# EAGLE design M8310F (EAGLE 6.6.0)

## Sheet 1 of 3
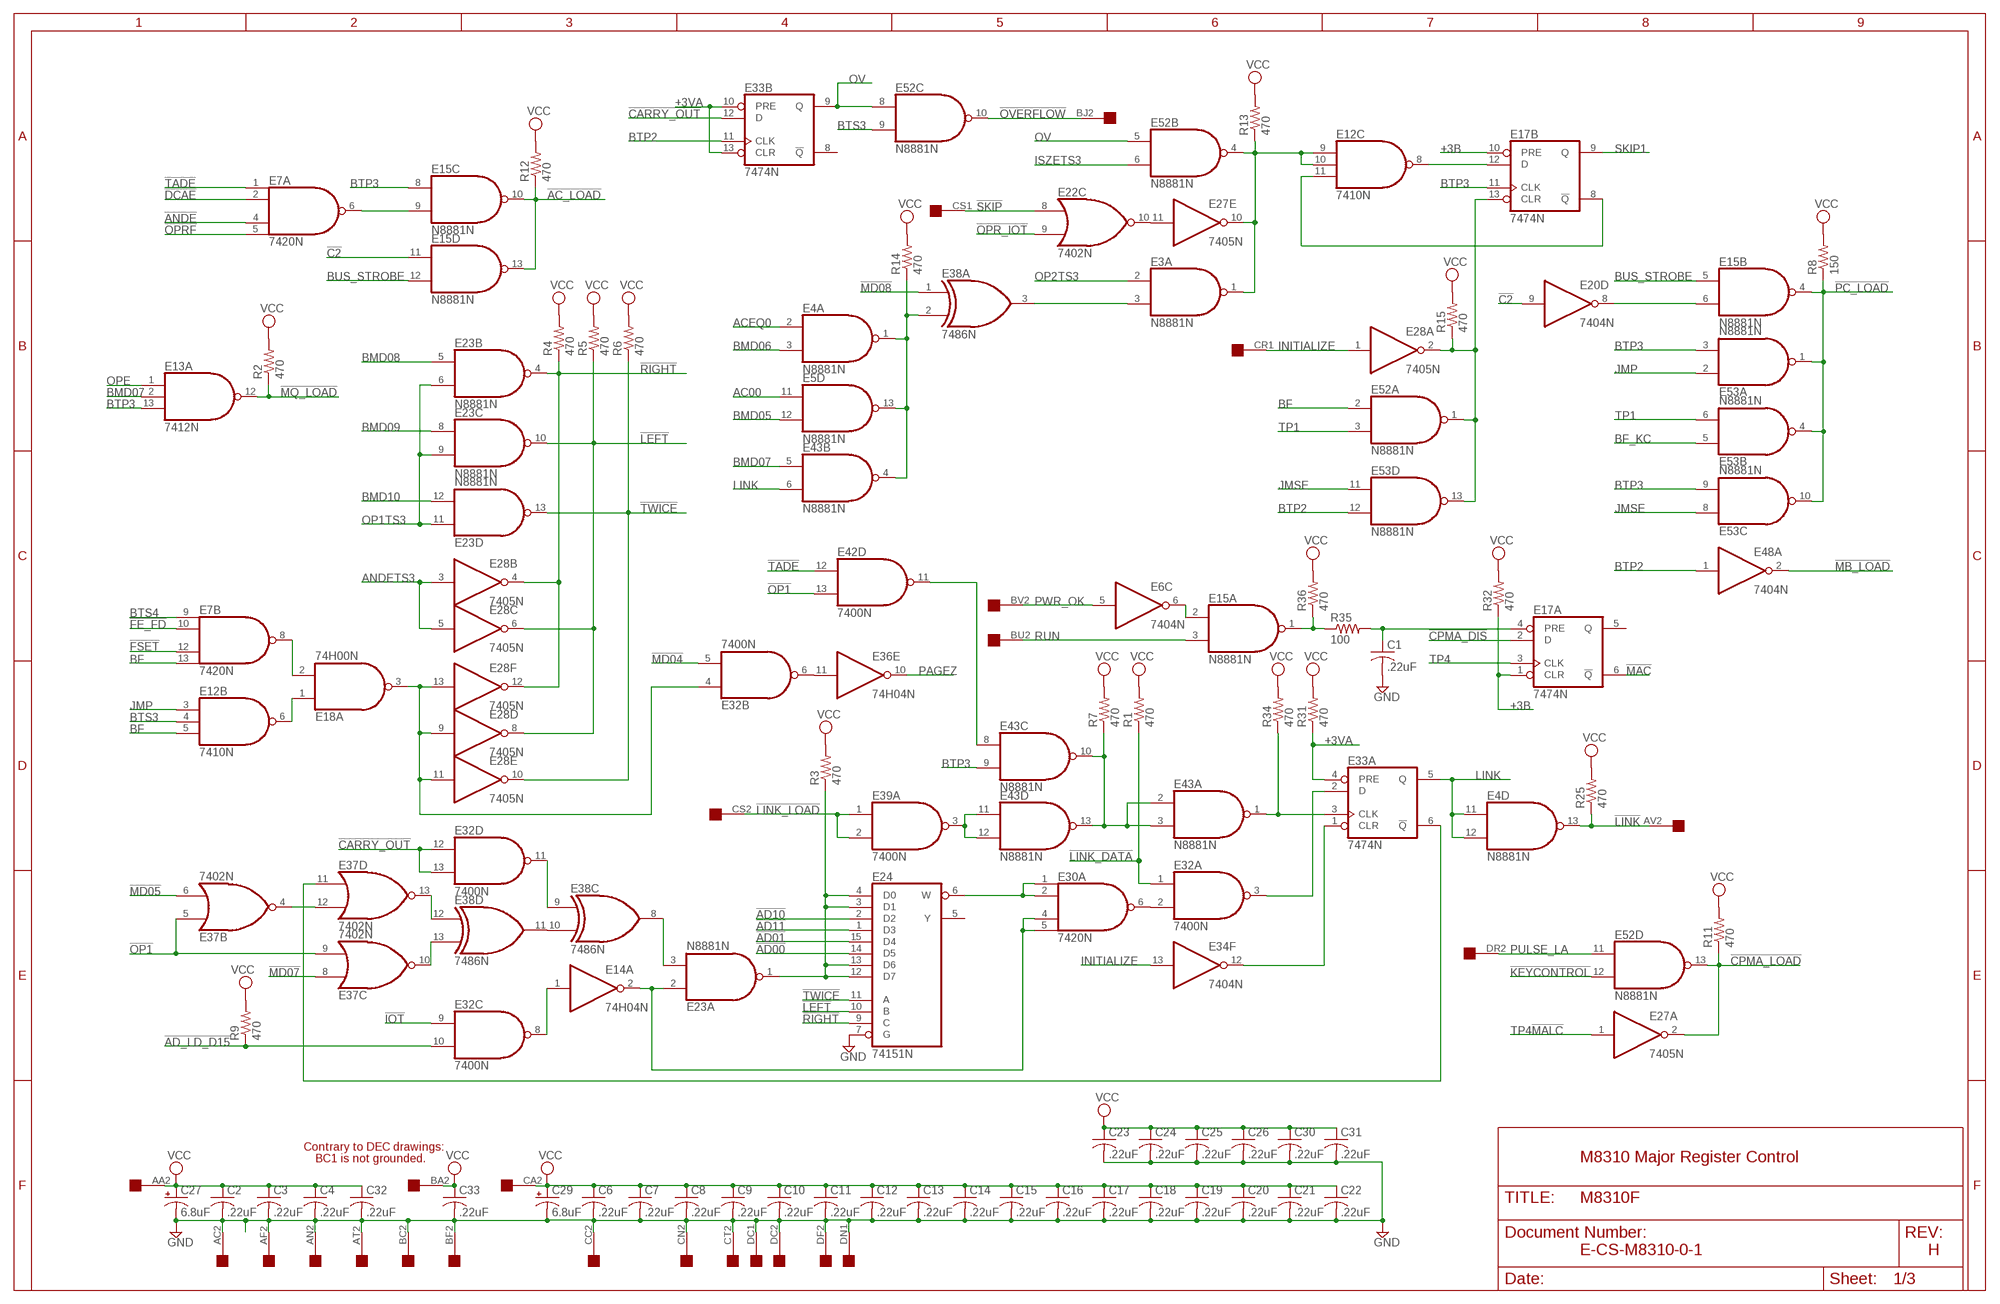
[diagram p0: schematic, sheet 1]

### Parts
C1  .22uF  C-US  [C063-025X075]
C2  .22uF  C-US  [C063-025X075]
C3  .22uF  C-US  [C063-025X075]
C4  .22uF  C-US  [C063-025X075]
C6  .22uF  C-US  [C063-025X075]
C7  .22uF  C-US  [C063-025X075]
C8  .22uF  C-US  [C063-025X075]
C9  .22uF  C-US  [C063-025X075]
C10  .22uF  C-US  [C063-025X075]
C11  .22uF  C-US  [C063-025X075]
C12  .22uF  C-US  [C063-025X075]
C13  .22uF  C-US  [C063-025X075]
C14  .22uF  C-US  [C063-025X075]
C15  .22uF  C-US  [C063-025X075]
C16  .22uF  C-US  [C063-025X075]
C17  .22uF  C-US  [C063-025X075]
C18  .22uF  C-US  [C063-025X075]
C19  .22uF  C-US  [C063-025X075]
C20  .22uF  C-US  [C063-025X075]
C21  .22uF  C-US  [C063-025X075]
C22  .22uF  C-US  [C063-025X075]
C23  .22uF  C-US  [C063-025X075]
C24  .22uF  C-US  [C063-025X075]
C25  .22uF  C-US  [C063-025X075]
C26  .22uF  C-US  [C063-025X075]
C27  6.8uF  CPOL-USE20-8AXIAL  [E12-8]
C29  6.8uF  CPOL-USE20-8AXIAL  [E12-8]
C30  .22uF  C-US  [C063-025X075]
C31  .22uF  C-US  [C063-025X075]
C32  .22uF  C-US  [C063-025X075]
C33  .22uF  C-US  [C063-025X075]
E3  N8881N  [DIL14]
E4  N8881N  [DIL14]
E5  N8881N  [DIL14]
E6  7404N  [DIL14]
E7  7420N  74S20N  [DIL14]
E12  7410N  [DIL14]
E13  7412N  [DIL14]
E14  74H04N  7404N  [DIL14]
E15  N8881N  [DIL14]
E17  7474N  74S74N  [DIL14]
E18  74H00N  7400N  [DIL14]
E20  7404N  [DIL14]
E22  7402N  [DIL14]
E23  N8881N  [DIL14]
E24  74151N  [DIL16]
E27  7405N  [DIL14]
E28  7405N  [DIL14]
E30  7420N  74S20N  [DIL14]
E32  7400N  [DIL14]
E33  7474N  74S74N  [DIL14]
E34  7404N  [DIL14]
E36  74H04N  7404N  [DIL14]
E37  7402N  [DIL14]
E38  7486N  [DIL14]
E39  7400N  [DIL14]
E42  7400N  [DIL14]
E43  N8881N  [DIL14]
E48  7404N  [DIL14]
E52  N8881N  [DIL14]
E53  N8881N  [DIL14]
R1  470  R-US_0207/10  [0207/10]
R2  470  R-US_0207/10  [0207/10]
R3  470  R-US_0207/10  [0207/10]
R4  470  R-US_0207/10  [0207/10]
R5  470  R-US_0207/10  [0207/10]
R6  470  R-US_0207/10  [0207/10]
R7  470  R-US_0207/10  [0207/10]
R8  150  R-US_0207/10  [0207/10]
R9  470  R-US_0207/10  [0207/10]
R11  470  R-US_0207/10  [0207/10]
R12  470  R-US_0207/10  [0207/10]
R13  470  R-US_0207/10  [0207/10]
R14  470  R-US_0207/10  [0207/10]
R15  470  R-US_0207/10  [0207/10]
R25  470  R-US_0207/10  [0207/10]
R31  470  R-US_0207/10  [0207/10]
R32  470  R-US_0207/10  [0207/10]
R34  470  R-US_0207/10  [0207/10]
R35  100  R-US_0207/10  [0207/10]
R36  470  R-US_0207/10  [0207/10]
U$2  QUAD  [EDGE-CON8]

### Nets
!AC_LOAD: E15.10(C:O) E15.13(D:O) R12.1 ; also sheet 2
!AD00: E24.14(D5) ; also sheet 2
!AD01: E24.15(D4) ; also sheet 2
!AD10: E24.2(D2) ; also sheet 2
!AD11: E24.1(D3) ; also sheet 2
!AD_LD_D15: E32.10(C:I1) R9.1
!ANDE: E7.4(A:I2) ; also sheet 3
!C2: E15.11(D:I0) E20.9(D:I) ; also sheet 2
!CARRY_OUT: E32.12(D:I0) E32.13(D:I1) E33.12(B:D) ; also sheet 2
!CPMA_DIS: E17.2(A:D) ; also sheet 2
!CPMA_LOAD: E27.2(A:O) E52.13(D:O) R11.1 ; also sheet 2,3
!DCAE: E7.2(A:I1) ; also sheet 3
!FE_FD: E7.10(B:I1) ; also sheet 2,3
!FSET: E7.12(B:I2) ; also sheet 3
!IOT: E32.9(C:I0) ; also sheet 3
!KEYCONTROL: E52.12(D:I1) ; also sheet 3
!LEFT: E23.10(C:O) E24.10(B) E28.6(C:O) E28.8(D:O) R5.1 ; also sheet 2
!LINK: E4.13(D:O) R25.1 U$2.AV2
!LINK_DATA: E32.1(A:I0) R1.1
!LINK_LOAD: E39.1(A:I0) E39.2(A:I1) U$2.CS2
!MAC: E17.6(A:!Q) ; also sheet 2
!MB_LOAD: E48.2(A:O) ; also sheet 2
!MD04: E32.5(B:I1) ; also sheet 2
!MD05: E37.6(B:I1) ; also sheet 2
!MD07: E37.8(C:I0) ; also sheet 2
!MD08: E38.1(A:I0) ; also sheet 3
!MQ_LOAD: E13.12(A:O) R2.1 ; also sheet 2
!OP1: E37.5(B:I0) E37.9(C:I1) E42.13(D:I1) ; also sheet 3
!OPR_IOT: E22.9(C:I1) ; also sheet 3
!OPRF: E7.5(A:I3) ; also sheet 3
!OVERFLOW: E52.10(C:O) U$2.BJ2
!PC_LOAD: E15.4(B:O) E53.1(A:O) E53.4(B:O) E53.10(C:O) R8.1 ; also sheet 2
!RIGHT: E23.4(B:O) E24.9(C) E28.4(B:O) E28.12(F:O) R4.1 ; also sheet 2
!SKIP: E22.8(C:I0) U$2.CS1
!TADE: E7.1(A:I0) E42.12(D:I0) ; also sheet 3
!TWICE: E23.13(D:O) E24.11(A) E28.10(E:O) R6.1 ; also sheet 2
+3B: E17.1(A:CLR) E17.10(B:PRE) R32.1
+3VA: E33.4(A:PRE) E33.10(B:PRE) E33.13(B:CLR) R31.1
AC00: E5.11(D:I0) ; also sheet 2,3
ACEQ0: E4.2(A:I0) ; also sheet 2,3
ANDETS3: E28.3(B:I) E28.5(C:I) ; also sheet 3
BF: E7.13(B:I3) E12.5(B:I2) E52.2(A:I0) ; also sheet 2,3
BF_KC: E53.5(B:I0) ; also sheet 2,3
BMD05: E5.12(D:I1) ; also sheet 2
BMD06: E4.3(A:I1) ; also sheet 2
BMD07: E13.2(A:I1) E43.5(B:I0) ; also sheet 2
BMD08: E23.5(B:I0) ; also sheet 3
BMD09: E23.8(C:I0) ; also sheet 3
BMD10: E23.12(D:I1) ; also sheet 3
BTP2: E33.11(B:CLK) E48.1(A:I) E53.12(D:I1) ; also sheet 3
BTP3: E13.13(A:I2) E15.8(C:I0) E17.11(B:CLK) E43.9(C:I1) E53.3(A:I1) E53.9(C:I1) ; also sheet 3
BTS3: E12.4(B:I1) E52.9(C:I1) ; also sheet 2,3
BTS4: E7.9(B:I0) ; also sheet 2,3
BUS_STROBE: E15.5(B:I0) E15.12(D:I1) ; also sheet 3
GND [supply]: C1.2 C2.2 C3.2 C4.2 C6.2 C7.2 C8.2 C9.2 C10.2 C11.2 C12.2 C13.2 C14.2 C15.2 C16.2 C17.2 C18.2 C19.2 C20.2 C21.2 C22.2 C23.2 C24.2 C25.2 C26.2 C27.- C29.- C30.2 C31.2 C32.2 C33.2 E24.7(G) U$2.AC2 U$2.AF2 U$2.AN2 U$2.AT2 U$2.BC2 U$2.BF2 U$2.CC2 U$2.CN2 U$2.CT2 U$2.DC1 U$2.DC2 U$2.DF2 U$2.DN1 ; also sheet 3
INITIALIZE: E28.1(A:I) E34.13(F:I) U$2.CR1
ISZETS3: E52.6(B:I1) ; also sheet 3
JMP: E12.3(B:I0) E53.2(A:I0) ; also sheet 2,3
JMSE: E53.8(C:I0) E53.11(D:I0) ; also sheet 3
LINK: E4.11(D:I0) E4.12(D:I1) E33.5(A:Q) E43.6(B:I1)
N$3: E18.3(A:O) E28.9(D:I) E28.11(E:I) E28.13(F:I) E32.4(B:I0)
N$4: E7.8(B:O) E18.2(A:I1)
N$5: E12.6(B:O) E18.1(A:I0)
N$6: E33.3(A:CLK) E43.1(A:O) R34.1
N$7: E33.1(A:CLR) E34.12(F:O)
N$8: E32.3(A:O) E33.2(A:D)
N$9: E43.2(A:I0) E43.3(A:I1) E43.10(C:O) E43.13(D:O) R7.1
N$10: E39.3(A:O) E43.11(D:I0) E43.12(D:I1)
N$11: E32.6(B:O) E36.11(E:I)
N$12: E30.6(A:O) E32.2(A:I1)
N$13: E24.6(W) E30.1(A:I0) E30.2(A:I1)
N$14: E23.3(A:I1) E38.8(C:O)
N$15: E14.2(A:O) E23.2(A:I0) E30.4(A:I2) E30.5(A:I3)
N$16: E23.1(A:O) E24.3(D1) E24.4(D0) E24.12(D7) E24.13(D6) R3.1
N$17: E15.1(A:O) R35.1 R36.1
N$18: E38.10(C:I1) E38.11(D:O)
N$19: E37.4(B:O) E37.12(D:I1)
N$20: E37.13(D:O) E38.12(D:I0)
N$21: E37.10(C:O) E38.13(D:I1)
N$22: E33.6(A:!Q) E37.11(D:I0)
N$23: E14.1(A:I) E32.8(C:O)
N$24: E32.11(D:O) E38.9(C:I0)
N$25: E6.6(C:O) E15.2(A:I0)
N$26: C1.1 E17.4(A:PRE) R35.2
N$28: E7.6(A:O) E15.9(C:I1)
N$29: E22.10(C:O) E27.11(E:I)
N$30: E3.1(A:O) E12.9(C:I0) E12.10(C:I1) E27.10(E:O) E52.4(B:O) R13.1
N$31: E15.6(B:I1) E20.8(D:O)
N$32: E12.8(C:O) E17.12(B:D)
N$33: E12.11(C:I2) E17.8(B:!Q)
N$34: E17.13(B:CLR) E28.2(A:O) E52.1(A:O) E53.13(D:O) R15.1
N$35: E4.1(A:O) E5.13(D:O) E38.2(A:I1) E43.4(B:O) R14.1
N$43: E3.3(A:I1) E38.3(A:O)
N$81: E42.11(D:O) E43.8(C:I0)
OP1TS3: E23.6(B:I1) E23.9(C:I1) E23.11(D:I0) ; also sheet 2,3
OP2TS3: E3.2(A:I0) ; also sheet 3
OPE: E13.1(A:I0) ; also sheet 2,3
OV: E33.9(B:Q) E52.5(B:I0) E52.8(C:I0)
PAGEZ: E36.10(E:O) ; also sheet 2
PULSE_LA: E52.11(D:I0) U$2.DR2
PWR_OK: E6.5(C:I) U$2.BV2
RUN: E15.3(A:I1) U$2.BU2
SKIP1: E17.9(B:Q) ; also sheet 2
TP1: E52.3(A:I1) E53.6(B:I1) ; also sheet 3
TP4: E17.3(A:CLK) ; also sheet 3
TP4!MALC: E27.1(A:I) ; also sheet 3
VCC [supply]: C2.1 C3.1 C4.1 C6.1 C7.1 C8.1 C9.1 C10.1 C11.1 C12.1 C13.1 C14.1 C15.1 C16.1 C17.1 C18.1 C19.1 C20.1 C21.1 C22.1 C23.1 C24.1 C25.1 C26.1 C27.+ C29.+ C30.1 C31.1 C32.1 C33.1 R1.2 R2.2 R3.2 R4.2 R5.2 R6.2 R7.2 R8.2 R9.2 R11.2 R12.2 R13.2 R14.2 R15.2 R25.2 R31.2 R32.2 R34.2 R36.2 U$2.AA2 U$2.BA2 U$2.CA2 ; also sheet 2,3
Unconnected: E6.1(A:I) E6.2(A:O) E6.3(B:I) E6.4(B:O) E6.8(D:O) E6.9(D:I) E17.5(A:Q) E24.5(Y) E33.8(B:!Q) U$2.AA1 U$2.AB1 U$2.AB2 U$2.AC1 U$2.AD1 U$2.AD2 U$2.AE1 U$2.AE2 U$2.AF1 U$2.AH1 U$2.AH2 U$2.AJ1 U$2.AJ2 U$2.AK2 U$2.AL2 U$2.AM2 U$2.AN1 U$2.AP2 U$2.AR1 U$2.AR2 U$2.AS1 U$2.AS2 U$2.AT1 U$2.AU1 U$2.AV1 U$2.BA1 U$2.BB1 U$2.BC1 U$2.BD1 U$2.BD2 U$2.BE1 U$2.BE2 U$2.BF1 U$2.BH1 U$2.BJ1 U$2.BL2 U$2.BN1 U$2.BN2 U$2.BR1 U$2.BR2 U$2.BS1 U$2.BS2 U$2.BT1 U$2.BT2 U$2.BU1 U$2.BV1 U$2.CA1 U$2.CB1 U$2.CB2 U$2.CC1 U$2.CF1 U$2.CF2 U$2.CL1 U$2.CM1 U$2.CN1 U$2.CP1 U$2.CR2 U$2.CT1 U$2.DA1 U$2.DA2 U$2.DB1 U$2.DB2 U$2.DD1 U$2.DE1 U$2.DF1 U$2.DH1 U$2.DJ1 U$2.DJ2 U$2.DK2 U$2.DL2 U$2.DM2 U$2.DN2 U$2.DR1 U$2.DS1 U$2.DS2 U$2.DT1 U$2.DT2 U$2.DU1 U$2.DV1 U$2.DV2

### Notes on the sheet
- Contrary to DEC drawings:
- BC1 is not grounded. | M8310 Major Register Control
- E-CS-M8310-0-1 | H

## Sheet 2 of 3
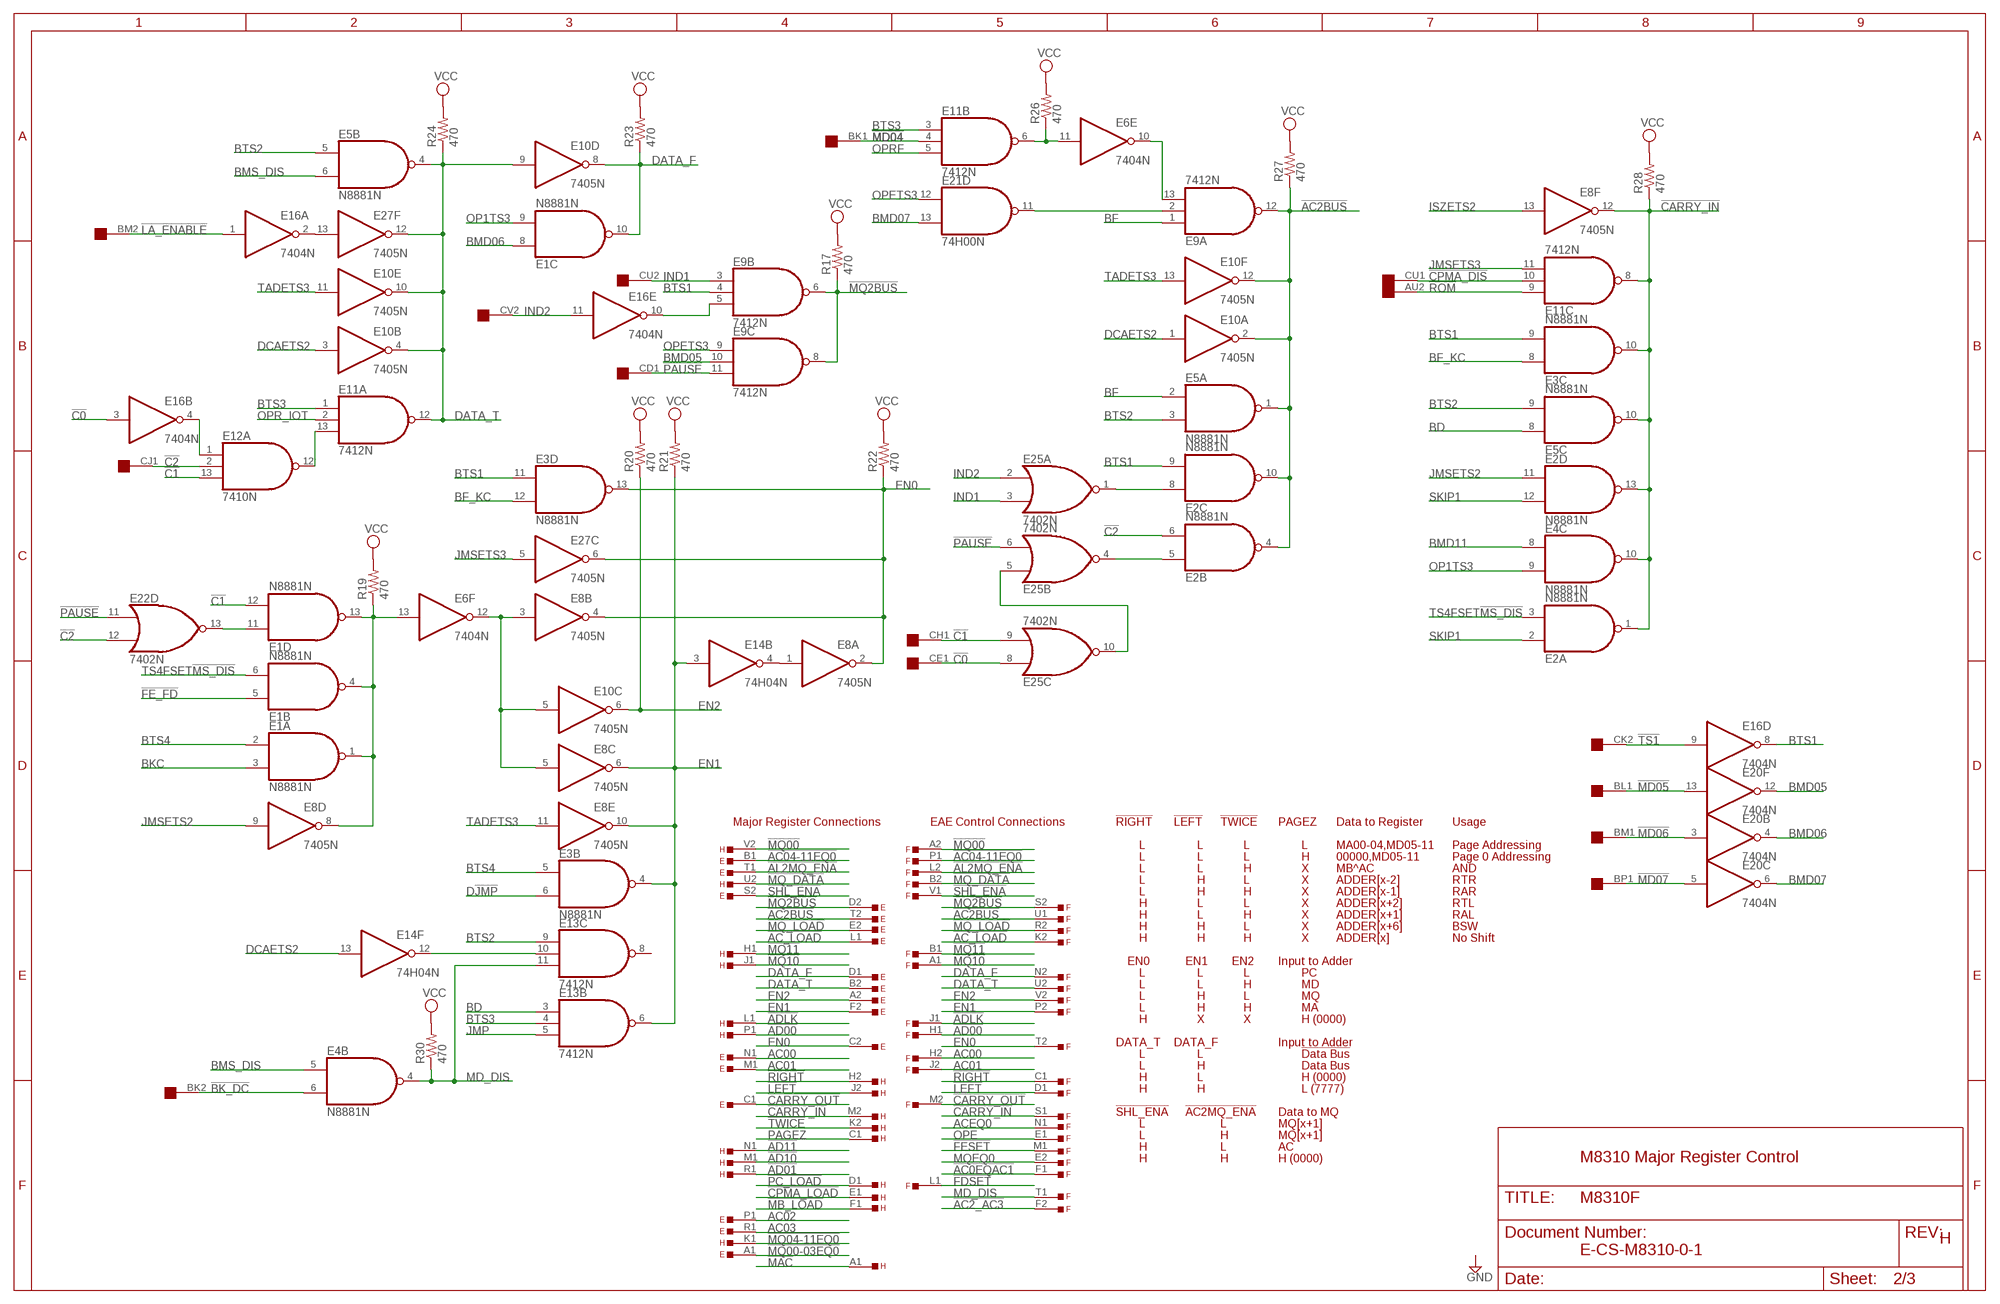
[diagram p1: schematic, sheet 2]

### Parts
E  EDGE-TOP  [EDGE-CON2]
E1  N8881N  [DIL14]
E2  N8881N  [DIL14]
E8  7405N  [DIL14]
E9  7412N  [DIL14]
E10  7405N  [DIL14]
E11  7412N  [DIL14]
E16  7404N  [DIL14]
E21  74H00N  7400N  [DIL14]
E25  7402N  [DIL14]
F  EDGE-TOP  [EDGE-CON2]
H  EDGE-TOP  [EDGE-CON2]
R17  470  R-US_0207/10  [0207/10]
R19  470  R-US_0207/10  [0207/10]
R20  470  R-US_0207/10  [0207/10]
R21  470  R-US_0207/10  [0207/10]
R22  470  R-US_0207/10  [0207/10]
R23  470  R-US_0207/10  [0207/10]
R24  470  R-US_0207/10  [0207/10]
R26  470  R-US_0207/10  [0207/10]
R27  470  R-US_0207/10  [0207/10]
R28  470  R-US_0207/10  [0207/10]
R30  470  R-US_0207/10  [0207/10]

### Nets
!AC0EQAC1: F.F1 ; also sheet 3
!AC2_AC3: F.F2 ; also sheet 3
!AC2BUS: E2.4(B:O) E2.10(C:O) E5.1(A:O) E9.12(A:O) E10.2(A:O) E10.12(F:O) E.T2 F.U1 R27.1
!AC04-11EQ0: E.B1 F.P1 ; also sheet 3
!AC_LOAD: E.L1 F.K2 ; also sheet 1
!AD00: F.H1 H.P1 ; also sheet 1
!AD01: H.R1 ; also sheet 1
!AD10: H.M1 ; also sheet 1
!AD11: H.N1 ; also sheet 1
!ADLK: F.J1 H.L1
!AL2MQ_ENA: E.T1 F.L2
!BK_DC: E4.6(B:I1) U$2.BK2
!C0: E16.3(B:I) E25.8(C:I0) U$2.CE1
!C1: E1.12(D:I1) E12.13(A:I2) E25.9(C:I1) U$2.CH1
!C2: E2.6(B:I1) E12.2(A:I1) E22.12(D:I1) U$2.CJ1 ; also sheet 1
!CARRY_IN: E2.1(A:O) E2.13(D:O) E3.10(C:O) E4.10(C:O) E5.10(C:O) E8.12(F:O) E11.8(C:O) F.S1 H.M2 R28.1
!CARRY_OUT: E.C1 F.M2 ; also sheet 1
!CPMA_DIS: E11.10(C:I1) U$2.CU1 ; also sheet 1
!CPMA_LOAD: H.E1 ; also sheet 1,3
!FDSET: F.L1 ; also sheet 3
!FE_FD: E1.5(B:I0) ; also sheet 1,3
!FESET: F.M1 ; also sheet 3
!LA_ENABLE: E16.1(A:I) U$2.BM2
!LEFT: F.D1 H.J2 ; also sheet 1
!MAC: H.A1 ; also sheet 1
!MB_LOAD: H.F1 ; also sheet 1
!MD04: E11.4(B:I1) U$2.BK1 ; also sheet 1
!MD05: E20.13(F:I) U$2.BL1 ; also sheet 1
!MD06: E20.3(B:I) U$2.BM1
!MD07: E20.5(C:I) U$2.BP1 ; also sheet 1
!MQ00: F.A2 H.V2
!MQ00-03EQ0: E.A1 ; also sheet 3
!MQ2BUS: E9.6(B:O) E9.8(C:O) E.D2 F.S2 R17.1
!MQ04-11EQ0: H.K1 ; also sheet 3
!MQ10: F.A1 H.J1
!MQ11: F.B1 H.H1
!MQ_DATA: F.B2 H.U2
!MQ_LOAD: E.E2 F.R2 ; also sheet 1
!PAUSE: E9.11(C:I2) E22.11(D:I0) E25.6(B:I1) U$2.CD1
!PC_LOAD: H.D1 ; also sheet 1
!RIGHT: F.C1 H.H2 ; also sheet 1
!ROM: E11.9(C:I0) U$2.AU2
!SHL_ENA: E.S2 F.V1
!TS1: E16.9(D:I) U$2.CK2
!TWICE: H.K2 ; also sheet 1
AC00: E.N1 F.H2 ; also sheet 1,3
AC01: E.M1 F.J2 ; also sheet 3
AC02: E.P1 ; also sheet 3
AC03: E.R1 ; also sheet 3
ACEQ0: F.N1 ; also sheet 1,3
BD: E5.8(C:I0) E13.3(B:I0) ; also sheet 3
BF: E5.2(A:I0) E9.1(A:I0) ; also sheet 1,3
BF_KC: E3.8(C:I0) E3.12(D:I1) ; also sheet 1,3
BKC: E1.3(A:I1) ; also sheet 3
BMD05: E9.10(C:I1) E20.12(F:O) ; also sheet 1
BMD06: E1.8(C:I0) E20.4(B:O) ; also sheet 1
BMD07: E20.6(C:O) E21.13(D:I1) ; also sheet 1
BMD11: E4.8(C:I0) ; also sheet 3
BMS_DIS: E4.5(B:I0) E5.6(B:I1) ; also sheet 3
BTS1: E2.9(C:I1) E3.9(C:I1) E3.11(D:I0) E9.4(B:I1) E16.8(D:O)
BTS2: E5.3(A:I1) E5.5(B:I0) E5.9(C:I1) E13.9(C:I0) ; also sheet 3
BTS3: E11.1(A:I0) E11.3(B:I0) E13.4(B:I1) ; also sheet 1,3
BTS4: E1.2(A:I0) E3.5(B:I0) ; also sheet 1,3
D!JMP: E3.6(B:I1) ; also sheet 3
DATA_F: E1.10(C:O) E10.8(D:O) E.D1 F.N2 R23.1
DATA_T: E5.4(B:O) E10.4(B:O) E10.9(D:I) E10.10(E:O) E11.12(A:O) E27.12(F:O) E.B2 F.U2 R24.1
DCAETS2: E10.1(A:I) E10.3(B:I) E14.13(F:I) ; also sheet 3
EN0: E3.13(D:O) E8.2(A:O) E8.4(B:O) E27.6(C:O) E.C2 F.T2 R22.1
EN1: E3.4(B:O) E8.6(C:O) E8.10(E:O) E13.6(B:O) E14.3(B:I) E.F2 F.P2 R21.1
EN2: E10.6(C:O) E.A2 F.V2 R20.1
IND1: E9.3(B:I0) E25.3(A:I1) U$2.CU2
IND2: E16.11(E:I) E25.2(A:I0) U$2.CV2
ISZETS2: E8.13(F:I) ; also sheet 3
JMP: E13.5(B:I2) ; also sheet 1,3
JMSETS2: E2.11(D:I0) E8.9(D:I) ; also sheet 3
JMSETS3: E11.11(C:I2) E27.5(C:I) ; also sheet 3
MD_DIS: E4.4(B:O) E13.11(C:I2) F.T1 R30.1
MQEQ0: F.E2 ; also sheet 3
N$36: E1.11(D:I0) E22.13(D:O)
N$37: E1.1(A:O) E1.4(B:O) E1.13(D:O) E6.13(F:I) E8.8(D:O) R19.1
N$38: E16.2(A:O) E27.13(F:I)
N$39: E11.13(A:I2) E12.12(A:O)
N$40: E12.1(A:I0) E16.4(B:O)
N$42: E6.10(E:O) E9.13(A:I2)
N$44: E6.11(E:I) E11.6(B:O) R26.1
N$45: E9.2(A:I1) E21.11(D:O)
N$47: E9.5(B:I2) E16.10(E:O)
N$48: E6.12(F:O) E8.3(B:I) E8.5(C:I) E10.5(C:I)
N$49: E8.1(A:I) E14.4(B:O)
N$55: E2.8(C:I0) E25.1(A:O)
N$56: E2.5(B:I0) E25.4(B:O)
N$57: E13.10(C:I1) E14.12(F:O)
N$58: E25.5(B:I0) E25.10(C:O)
OP1TS3: E1.9(C:I1) E4.9(C:I1) ; also sheet 1,3
OPE: F.E1 ; also sheet 1,3
OPETS3: E9.9(C:I0) E21.12(D:I0) ; also sheet 3
OPR_IOT: E11.2(A:I1) ; also sheet 3
OPRF: E11.5(B:I2) ; also sheet 3
PAGEZ: H.C1 ; also sheet 1
SKIP1: E2.2(A:I0) E2.12(D:I1) ; also sheet 1
TADETS3: E8.11(E:I) E10.11(E:I) E10.13(F:I) ; also sheet 3
TS4FSET!MS_DIS: E1.6(B:I1) E2.3(A:I1) ; also sheet 3
VCC [supply]: R17.2 R19.2 R20.2 R21.2 R22.2 R23.2 R24.2 R26.2 R27.2 R28.2 R30.2 ; also sheet 1,3
Unconnected: E13.8(C:O) E.E1 E.F1 E.H1 E.H2 E.J1 E.J2 E.K1 E.K2 E.L2 E.M2 E.N2 E.P2 E.R2 E.S1 E.U1 E.U2 E.V1 E.V2 F.C2 F.D2 F.K1 F.R1 H.A2 H.B1 H.B2 H.C2 H.D2 H.E2 H.F2 H.L2 H.N2 H.P2 H.R2 H.S1 H.S2 H.T1 H.T2 H.U1 H.V1

### Notes on the sheet
- Major Register Connections | EAE Control Connections | !RIGHT | !LEFT | !TWICE | PAGEZ | Data to Register | Usage
- L | L | L | L | MA00-04,MD05-11 | Page Addressing
- L | L | L | H | 00000,MD05-11 | Page 0 Addressing
- L | L | H | X | MB^AC | AND
- L | H | L | X | ADDER[x-2] | RTR
- L | H | H | X | ADDER[x-1] | RAR
- H | L | L | X | ADDER[x+2] | RTL
- H | L | H | X | ADDER[x+1] | RAL
- H | H | L | X | ADDER[x+6] | BSW
- H | H | H | X | ADDER[x] | No Shift
- EN0 | EN1 | EN2 | Input to Adder
- L | L | L | PC
- L | L | H | MD
- L | H | L | MQ
- L | H | H | MA
- H | X | X | H (0000)
- DATA_T | DATA_F | Input to Adder
- L | L | !Data Bus
- L | H | Data Bus
- H | L | H (0000)
- H | H | L (7777)
- !SHL_ENA | !AC2MQ_ENA | Data to MQ
- L | L | MQ[x+1]
- L | H | MQ[x+1]
- H | L | AC
- H | H | H (0000) | M8310 Major Register Control
- H
- E-CS-M8310-0-1

## Sheet 3 of 3
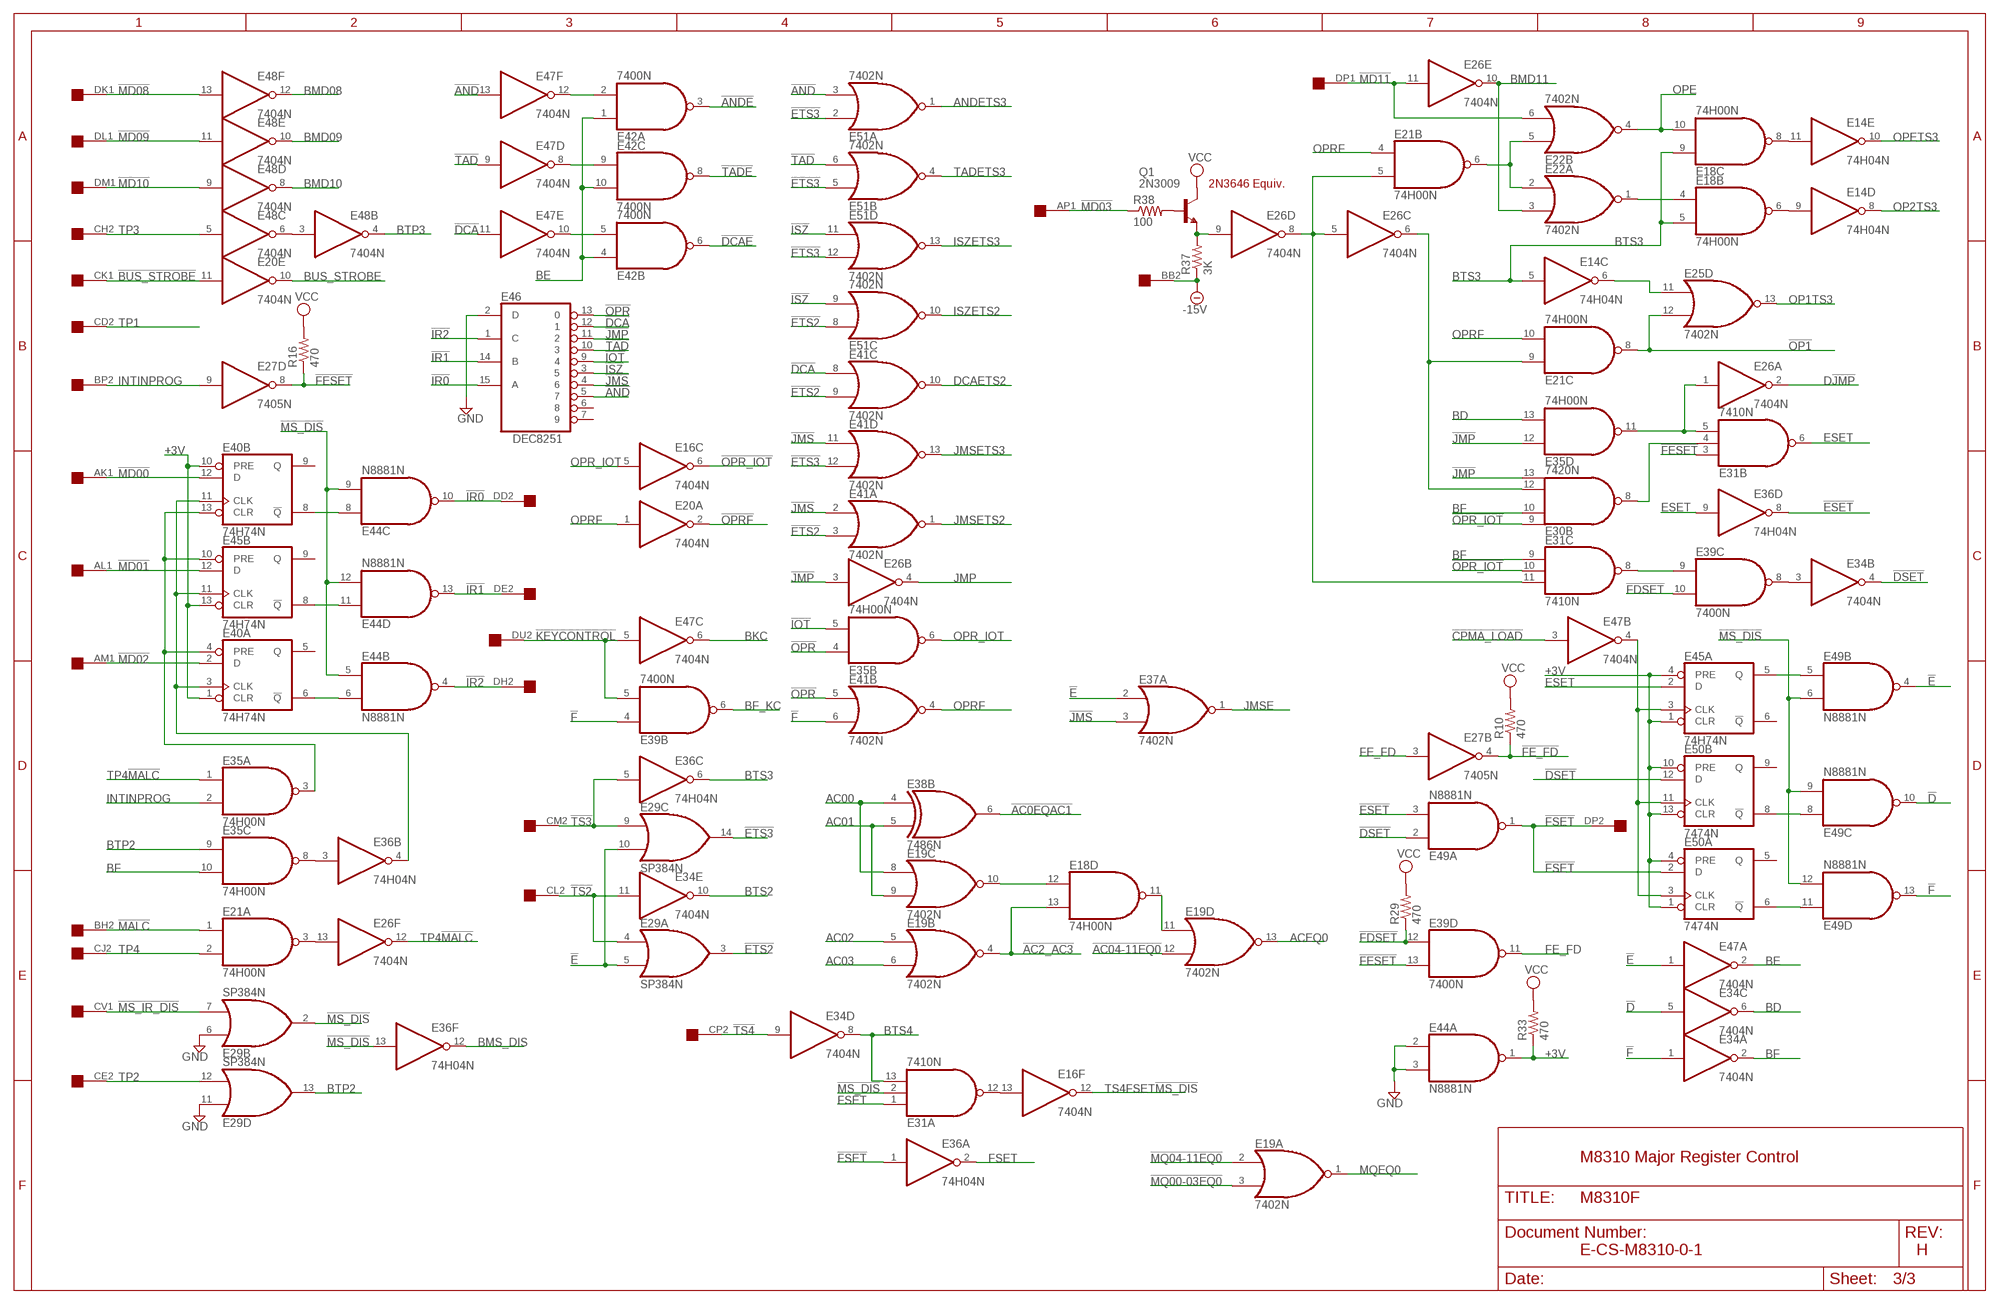
[diagram p2: schematic, sheet 3]

### Parts
E19  7402N  [DIL14]
E26  7404N  [DIL14]
E29  SP384N  [DIL14]
E31  7410N  [DIL14]
E35  74H00N  7400N  [DIL14]
E40  74H74N  74S74N  [DIL14]
E41  7402N  [DIL14]
E44  N8881N  [DIL14]
E45  74H74N  74S74N  [DIL14]
E46  DEC8251  [DIL16]
E47  7404N  [DIL14]
E49  N8881N  [DIL14]
E50  7474N  74S74N  [DIL14]
E51  7402N  [DIL14]
Q1  2N3009  -NPN-TO5  [TO5]
R10  470  R-US_0207/10  [0207/10]
R16  470  R-US_0207/10  [0207/10]
R29  470  R-US_0207/10  [0207/10]
R33  470  R-US_0207/10  [0207/10]
R37  3K  R-US_0207/10  [0207/10]
R38  100  R-US_0207/10  [0207/10]

### Nets
!AC0EQAC1: E38.6(B:O) ; also sheet 2
!AC2_AC3: E18.13(D:I1) E19.4(B:O) ; also sheet 2
!AC04-11EQ0: E19.12(D:I1) ; also sheet 2
!AND: E46.5 E47.13(F:I) E51.3(A:I1)
!ANDE: E42.3(A:O) ; also sheet 1
!BUS_STROBE: E20.11(E:I) U$2.CK1
!CPMA_LOAD: E47.3(B:I) ; also sheet 1,2
!D: E34.5(C:I) E49.10(C:O)
!DCA: E41.8(C:I0) E46.12 E47.11(E:I)
!DCAE: E42.6(B:O) ; also sheet 1
!DSET: E34.4(B:O) E49.2(A:I0) E50.12(B:D)
!E: E29.5(A:I1) E29.10(C:I1) E37.2(A:I0) E47.1(A:I) E49.4(B:O)
!ESET: E36.8(D:O) E49.3(A:I1)
!ETS2: E29.3(A:O) E41.3(A:I1) E41.9(C:I1) E51.8(C:I0)
!ETS3: E29.14(C:O) E41.12(D:I1) E51.2(A:I0) E51.5(B:I0) E51.12(D:I1)
!F: E34.1(A:I) E39.4(B:I0) E41.6(B:I1) E49.13(D:O)
!FDSET: E39.10(C:I1) E39.12(D:I0) R29.1 ; also sheet 2
!FE_FD: E27.4(B:O) R10.1 ; also sheet 1,2
!FESET: E27.8(D:O) E31.3(B:I0) E39.13(D:I1) R16.1 ; also sheet 2
!FSET: E36.1(A:I) E49.1(A:O) E50.2(A:D) U$2.DP2 ; also sheet 1
!IOT: E35.5(B:I1) E46.9 ; also sheet 1
!IR0: E44.10(C:O) E46.15(A) U$2.DD2
!IR1: E44.13(D:O) E46.14(B) U$2.DE2
!IR2: E44.4(B:O) E46.1(C) U$2.DH2
!ISZ: E46.3 E51.9(C:I1) E51.11(D:I0)
!JMP: E26.3(B:I) E30.13(B:I3) E35.12(D:I0) E46.11
!JMS: E37.3(A:I1) E41.2(A:I0) E41.11(D:I0) E46.4
!KEYCONTROL: E39.5(B:I1) E47.5(C:I) U$2.DU2 ; also sheet 1
!MALC: E21.1(A:I0) U$2.BH2
!MD00: E40.12(B:D) U$2.AK1
!MD01: E45.12(B:D) U$2.AL1
!MD02: E40.2(A:D) U$2.AM1
!MD03: R38.1 U$2.AP1
!MD08: E48.13(F:I) U$2.DK1 ; also sheet 1
!MD09: E48.11(E:I) U$2.DL1
!MD10: E48.9(D:I) U$2.DM1
!MD11: E22.6(B:I1) E26.11(E:I) U$2.DP1
!MQ00-03EQ0: E19.3(A:I1) ; also sheet 2
!MQ04-11EQ0: E19.2(A:I0) ; also sheet 2
!MS_DIS: E29.2(B:O) E31.2(A:I1) E36.13(F:I) E44.5(B:I0) E44.9(C:I1) E44.12(D:I1) E49.6(B:I1) E49.9(C:I1) E49.12(D:I1)
!MS_IR_DIS: E29.7(B:I1) U$2.CV1
!OP1: E21.8(C:O) E25.12(D:I1) ; also sheet 1
!OPR: E35.4(B:I0) E41.5(B:I0) E46.13
!OPR_IOT: E16.6(C:O) E30.9(B:I0) E31.10(C:I1) ; also sheet 1
!OPRF: E20.2(A:O) ; also sheet 1
!TAD: E46.10 E47.9(D:I) E51.6(B:I1)
!TADE: E42.8(C:O) ; also sheet 1
!TS2: E29.4(A:I0) E34.11(E:I) U$2.CL2
!TS3: E29.9(C:I0) E36.5(C:I) U$2.CM2
!TS4: E34.9(D:I) U$2.CP2
+3V [supply]: E40.1(A:CLR) E40.10(B:PRE) E44.1(A:O) E45.1(A:CLR) E45.4(A:PRE) E45.13(B:CLR) E50.1(A:CLR) E50.4(A:PRE) E50.10(B:PRE) E50.13(B:CLR) R33.1
-15V: R37.1 U$2.BB2
AC00: E19.8(C:I0) E38.4(B:I0) ; also sheet 1,2
AC01: E19.9(C:I1) E38.5(B:I1) ; also sheet 2
AC02: E19.5(B:I0) ; also sheet 2
AC03: E19.6(B:I1) ; also sheet 2
ACEQ0: E19.13(D:O) ; also sheet 1,2
ANDETS3: E51.1(A:O) ; also sheet 1
BD: E34.6(C:O) E35.13(D:I1) ; also sheet 2
BE: E42.1(A:I0) E42.4(B:I0) E42.10(C:I1) E47.2(A:O)
BF: E30.10(B:I1) E31.9(C:I0) E34.2(A:O) E35.10(C:I1) ; also sheet 1,2
BF_KC: E39.6(B:O) ; also sheet 1,2
BKC: E47.6(C:O) ; also sheet 2
BMD08: E48.12(F:O) ; also sheet 1
BMD09: E48.10(E:O) ; also sheet 1
BMD10: E48.8(D:O) ; also sheet 1
BMD11: E22.3(A:I1) E26.10(E:O) ; also sheet 2
BMS_DIS: E36.12(F:O) ; also sheet 2
BTP2: E29.13(D:O) E35.9(C:I0) ; also sheet 1
BTP3: E48.4(B:O) ; also sheet 1
BTS2: E34.10(E:O) ; also sheet 2
BTS3: E14.5(C:I) E18.5(B:I1) E18.9(C:I0) E36.6(C:O) ; also sheet 1,2
BTS4: E31.13(A:I2) E34.8(D:O) ; also sheet 1,2
BUS_STROBE: E20.10(E:O) ; also sheet 1
CPMA_LOAD: E45.3(A:CLK) E47.4(B:O) E50.3(A:CLK) E50.11(B:CLK)
D!JMP: E26.2(A:O) ; also sheet 2
DCAETS2: E41.10(C:O) ; also sheet 2
ESET: E31.6(B:O) E36.9(D:I) E45.2(A:D)
FE_FD: E27.3(B:I) E39.11(D:O)
FSET: E31.1(A:I0) E36.2(A:O)
GND [supply]: E29.6(B:I0) E29.11(D:I0) E44.2(A:I0) E44.3(A:I1) E46.2(D) ; also sheet 1
INTINPROG: E27.9(D:I) E35.2(A:I1) U$2.BP2
ISZETS2: E51.10(C:O) ; also sheet 2
ISZETS3: E51.13(D:O) ; also sheet 1
JMP: E26.4(B:O) ; also sheet 1,2
JMSE: E37.1(A:O) ; also sheet 1
JMSETS2: E41.1(A:O) ; also sheet 2
JMSETS3: E41.13(D:O) ; also sheet 2
MQEQ0: E19.1(A:O) ; also sheet 2
N$1: Q1.2(B) R38.2
N$2: E26.9(D:I) Q1.1(E) R37.2
N$41: E48.3(B:I) E48.6(C:O)
N$46: E21.5(B:I1) E26.5(C:I) E26.8(D:O) E31.11(C:I2)
N$51: E42.2(A:I1) E47.12(F:O)
N$52: E42.9(C:I0) E47.8(D:O)
N$53: E42.5(B:I1) E47.10(E:O)
N$54: E21.3(A:O) E26.13(F:I)
N$59: E35.3(A:O) E40.4(A:PRE) E40.13(B:CLR) E45.10(B:PRE)
N$60: E40.8(B:!Q) E44.8(C:I0)
N$61: E44.11(D:I0) E45.8(B:!Q)
N$62: E40.6(A:!Q) E44.6(B:I1)
N$63: E21.6(B:O) E22.2(A:I0) E22.5(B:I0)
N$64: E35.8(C:O) E36.3(B:I)
N$65: E36.4(B:O) E40.3(A:CLK) E40.11(B:CLK) E45.11(B:CLK)
N$66: E26.1(A:I) E31.5(B:I2) E35.11(D:O)
N$67: E14.6(C:O) E25.11(D:I0)
N$69: E18.4(B:I0) E22.1(A:O)
N$70: E14.11(E:I) E18.8(C:O)
N$71: E14.9(D:I) E18.6(B:O)
N$72: E30.8(B:O) E31.4(B:I1)
N$73: E45.5(A:Q) E49.5(B:I0)
N$74: E34.3(B:I) E39.8(C:O)
N$75: E31.8(C:O) E39.9(C:I0)
N$76: E21.9(C:I0) E26.6(C:O) E30.12(B:I2)
N$77: E49.8(C:I0) E50.8(B:!Q)
N$78: E49.11(D:I0) E50.6(A:!Q)
N$79: E16.13(F:I) E31.12(A:O)
N$80: E18.11(D:O) E19.11(D:I0)
N$85: E18.12(D:I0) E19.10(C:O)
OP1TS3: E25.13(D:O) ; also sheet 1,2
OP2TS3: E14.8(D:O) ; also sheet 1
OPE: E18.10(C:I1) E22.4(B:O) ; also sheet 1,2
OPETS3: E14.10(E:O) ; also sheet 2
OPR_IOT: E16.5(C:I) E35.6(B:O) ; also sheet 2
OPRF: E20.1(A:I) E21.4(B:I0) E21.10(C:I1) E41.4(B:O) ; also sheet 2
TADETS3: E51.4(B:O) ; also sheet 2
TP1: U$2.CD2 ; also sheet 1
TP2: E29.12(D:I1) U$2.CE2
TP3: E48.5(C:I) U$2.CH2
TP4: E21.2(A:I1) U$2.CJ2 ; also sheet 1
TP4!MALC: E26.12(F:O) E35.1(A:I0) ; also sheet 1
TS4FSET!MS_DIS: E16.12(F:O) ; also sheet 2
VCC [supply]: Q1.3(C) R10.2 R16.2 R29.2 R33.2 ; also sheet 1,2
Unconnected: E40.5(A:Q) E40.9(B:Q) E45.6(A:!Q) E45.9(B:Q) E46.6 E46.7 E50.5(A:Q) E50.9(B:Q)

### Notes on the sheet
- 2N3646 Equiv.
- M8310 Major Register Control
- E-CS-M8310-0-1 | H

## Power pins joined to a net without a drawn wire
GND: E1.7(P:GND) E2.7(P:GND) E3.7(P:GND) E4.7(P:GND) E5.7(P:GND) E6.7(P:GND) E7.7(P:GND) E8.7(P:GND) E9.7(P:GND) E10.7(P:GND) E11.7(P:GND) E12.7(P:GND) E13.7(P:GND) E14.7(P:GND) E15.7(P:GND) E16.7(P:GND) E17.7(P:GND) E18.7(P:GND) E19.7(P:GND) E20.7(P:GND) E21.7(P:GND) E22.7(P:GND) E23.7(P:GND) E24.8(GND) E25.7(P:GND) E26.7(P:GND) E27.7(P:GND) E28.7(P:GND) E29.1(GND) E30.7(P:GND) E31.7(P:GND) E32.7(P:GND) E33.7(P:GND) E34.7(P:GND) E35.7(P:GND) E36.7(P:GND) E37.7(P:GND) E38.7(P:GND) E39.7(P:GND) E40.7(P:GND) E41.7(P:GND) E42.7(P:GND) E43.7(P:GND) E44.7(P:GND) E45.7(P:GND) E46.8(GND) E47.7(P:GND) E48.7(P:GND) E49.7(P:GND) E50.7(P:GND) E51.7(P:GND) E52.7(P:GND) E53.7(P:GND)
VCC: E1.14(P:VCC) E2.14(P:VCC) E3.14(P:VCC) E4.14(P:VCC) E5.14(P:VCC) E6.14(P:VCC) E7.14(P:VCC) E8.14(P:VCC) E9.14(P:VCC) E10.14(P:VCC) E11.14(P:VCC) E12.14(P:VCC) E13.14(P:VCC) E14.14(P:VCC) E15.14(P:VCC) E16.14(P:VCC) E17.14(P:VCC) E18.14(P:VCC) E19.14(P:VCC) E20.14(P:VCC) E21.14(P:VCC) E22.14(P:VCC) E23.14(P:VCC) E24.16(VCC) E25.14(P:VCC) E26.14(P:VCC) E27.14(P:VCC) E28.14(P:VCC) E29.8(VCC) E30.14(P:VCC) E31.14(P:VCC) E32.14(P:VCC) E33.14(P:VCC) E34.14(P:VCC) E35.14(P:VCC) E36.14(P:VCC) E37.14(P:VCC) E38.14(P:VCC) E39.14(P:VCC) E40.14(P:VCC) E41.14(P:VCC) E42.14(P:VCC) E43.14(P:VCC) E44.14(P:VCC) E45.14(P:VCC) E46.16(VCC) E47.14(P:VCC) E48.14(P:VCC) E49.14(P:VCC) E50.14(P:VCC) E51.14(P:VCC) E52.14(P:VCC) E53.14(P:VCC)

## Library data of the parts
C1-C4 C6-C26 C30-C33 = dec-con:C-US: Capacitors with funky DEC lead spacing.
C27 C29 = dec-con:CPOL-USE20-8AXIAL: A 0.8 inch electrolytic.
E F H = dec-con:EDGE-TOP: Labeled DEC edge connector, suitable for top connector.
E1-E5 E15 E23 E43 E44 E49 E52 E53 = dec-con:N8881: Quad 2-input NAND gate, open collector
E6 E14 E16 E20 E26 E34 E36 E47 E48 = 74xx-us:74*04: Hex INVERTER
E7 E30 = 74xx-us:74*20: Dual 4-input NAND gate
E8 E10 E27 E28 = 74xx-us:74*05: Hex INVERTER, open collector
E9 E11 E13 = 74xx-us:74*12: Triple 3-input NAND gate, open collector
E12 E31 = 74xx-us:74*10: Triple 3-input NAND gate
E17 E33 E40 E45 E50 = 74xx-us:74*74: Dual D type positive edge triggered FLIP FLOP, preset and clear
E18 E21 E32 E35 E39 E42 = 74xx-us:74*00: Quad 2-input NAND gate
E19 E22 E25 E37 E41 E51 = 74xx-us:74*02: Quad 2-input NOR gate
E24 = 74xx-us:74*151: Data SELECTOR/MULTIPLEXER
E29 = dec-con:SP384: Quad OR gate
E38 = 74xx-us:74*86: Quad 2-input EXCLUSIV-OR (XOR) gate
E46 = dec-con:DEC8251: BCD Decoder
Q1 = transistor:*-NPN-: NPN Transistror BF959 corrected 2008.03.06
R1-R17 R19-R38 = rcl:R-US_: RESISTOR, American symbol
U$2 = dec-con:QUAD: Quad-Height DEC board

## Net classes
1 supply: width 0.813 mm

## Board
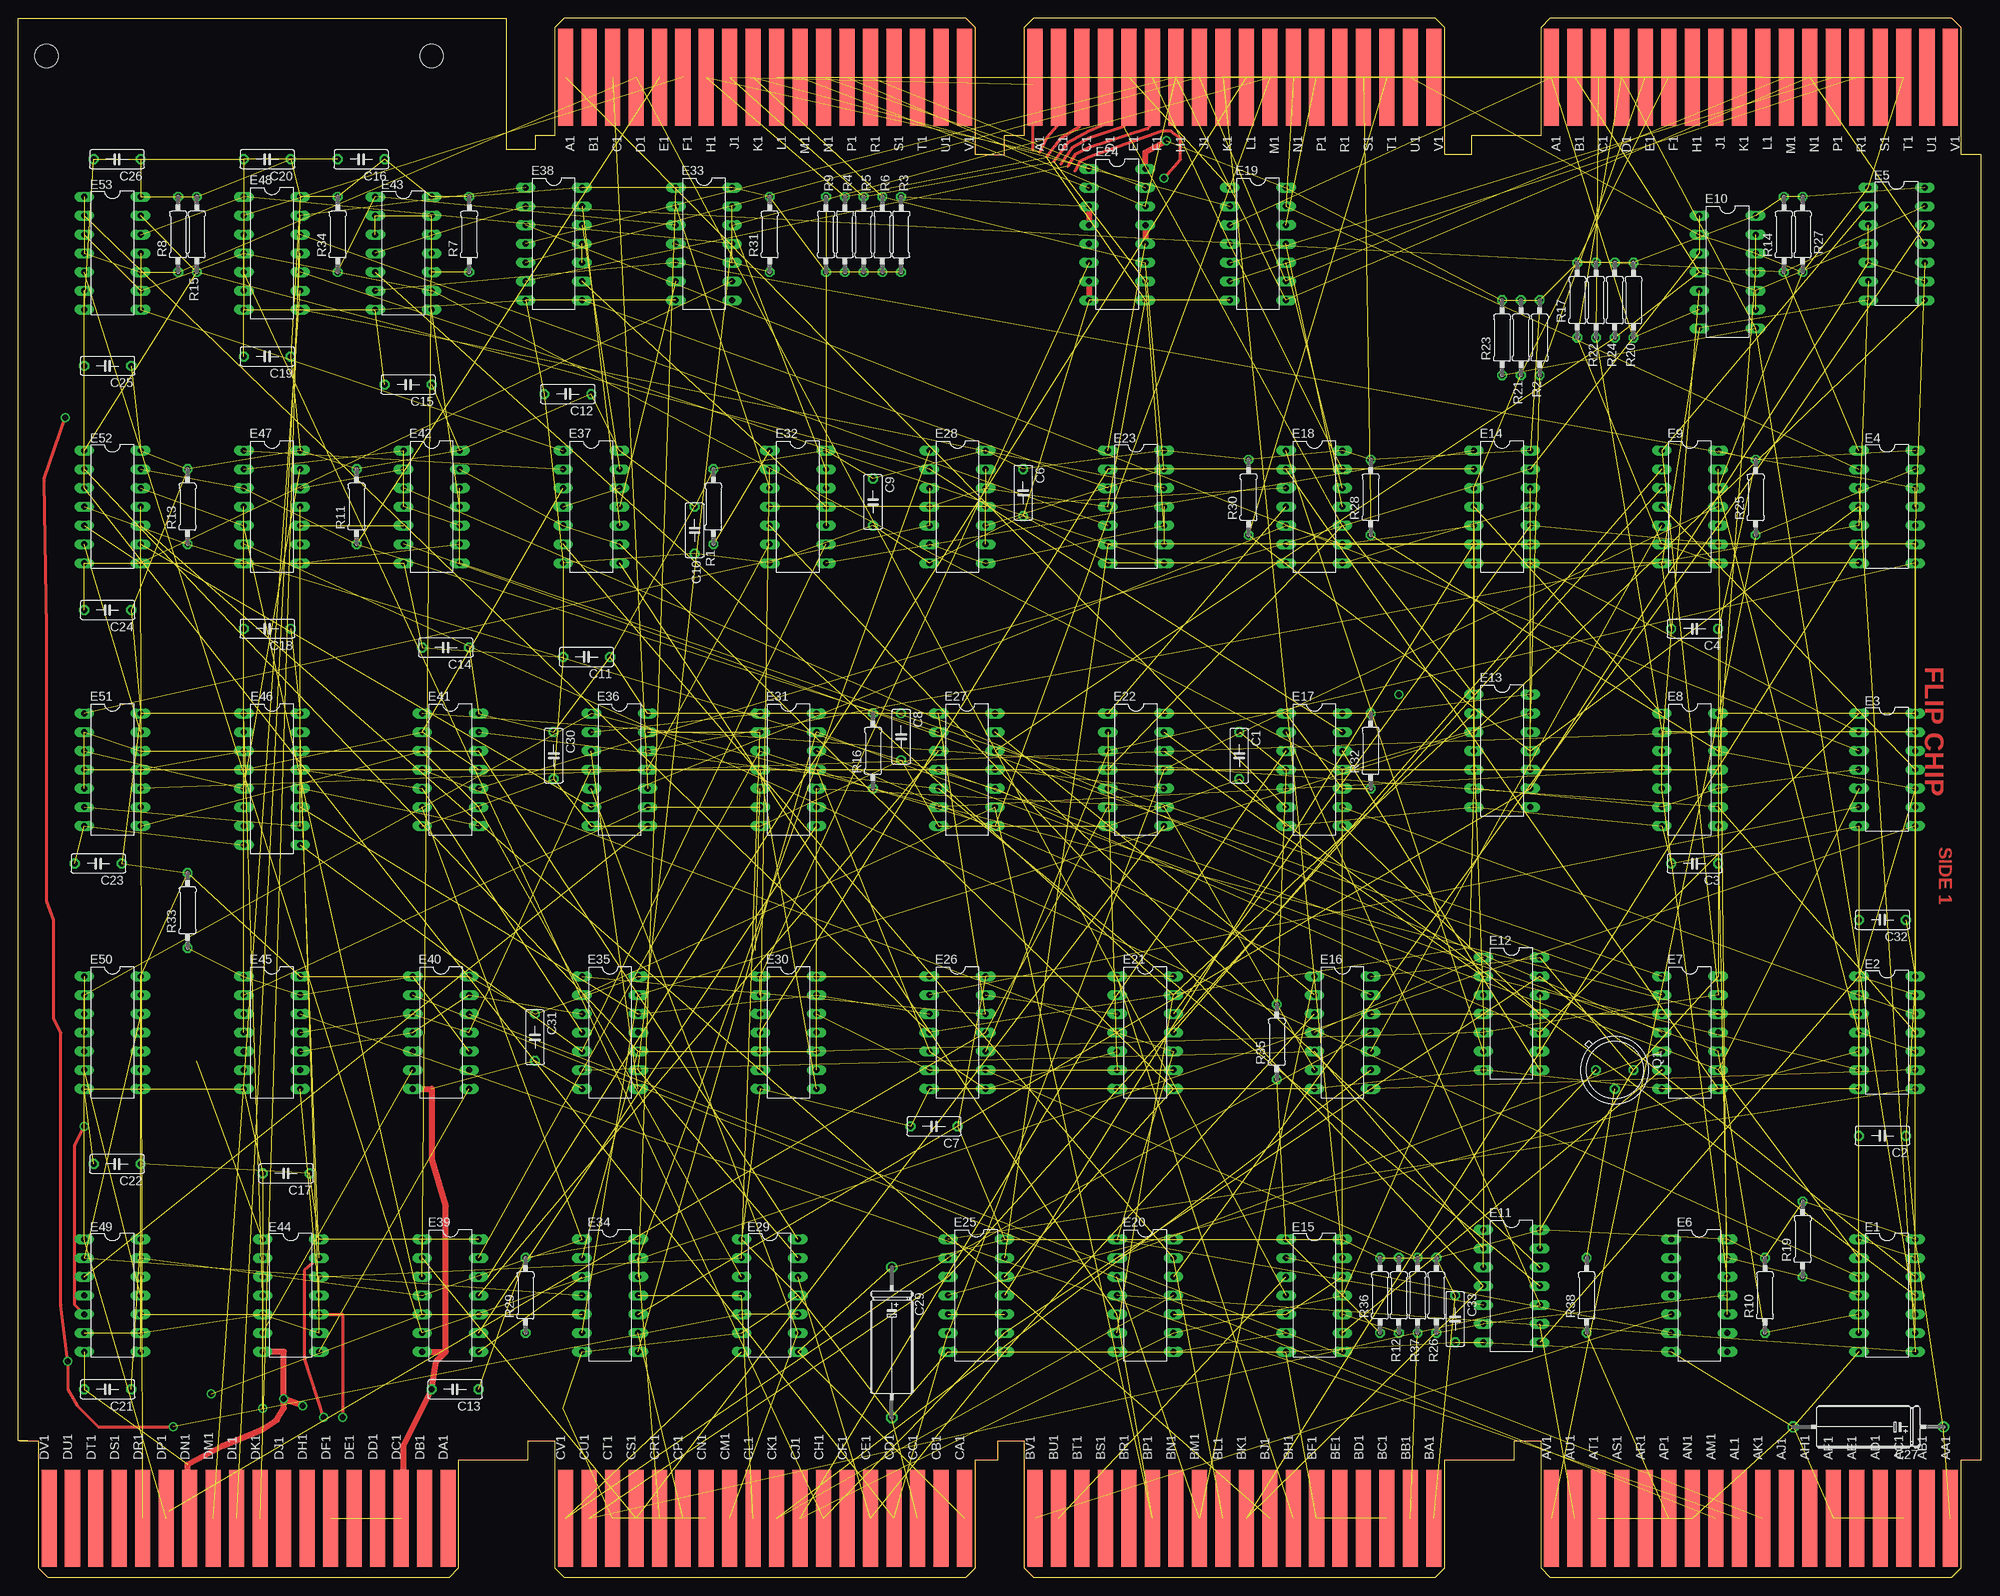
[diagram p3: board, top side]
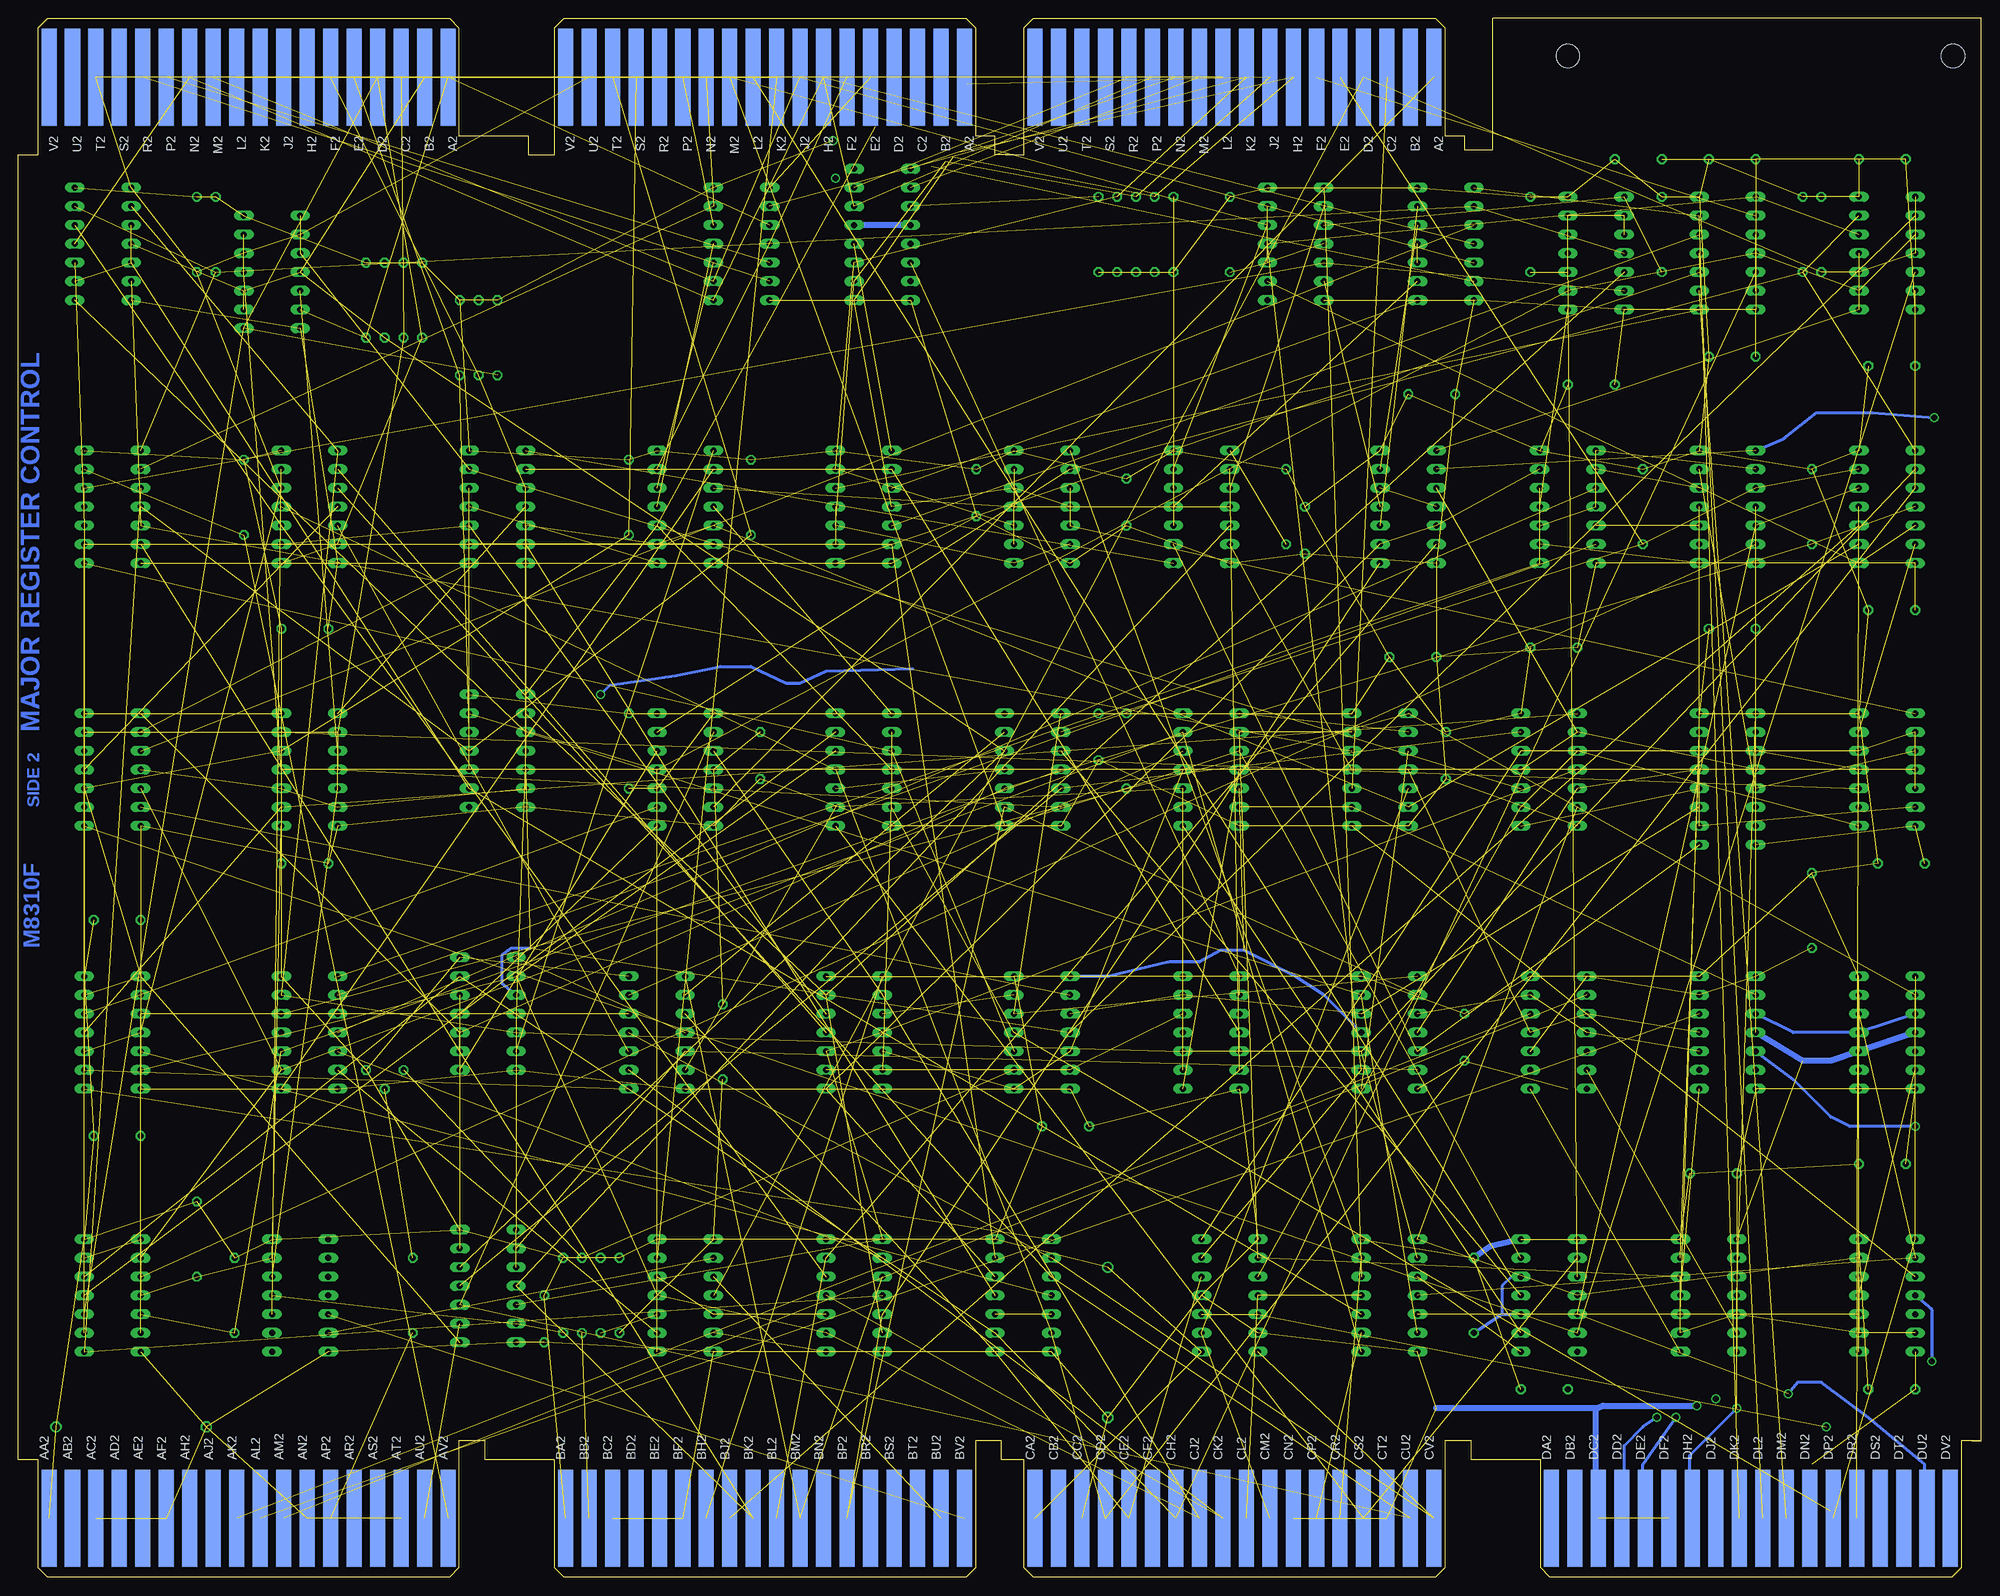
[diagram p4: board, bottom side, seen from below]

Size 265.43 x 210.82 mm. Coordinates in mm from the lower left corner, seen from the top.
Outline: 203.2,194.94 196.53,194.94 196.53,192.41 195.26,192.41
Outline: 1.27,18.41 0,18.41 0,210.82 66.04,210.82 66.04,193.04 69.85,193.04 69.85,194.94
Outline: 265.43,15.88 265.43,192.41 264.16,192.41
Outline: 130.81,192.41 133.35,192.41 133.35,194.94
Copper layers (1+16): Top 0.035mm / dielectric 1.5mm / Bottom 0.035mm
Design rules "16mils": minimum track width 16mil, minimum drill 32mil, track to track 15mil, track to pad 10mil, pad to pad 10mil, via to via 10mil, smd to smd 10mil, copper to edge 13mil, drill to drill 10mil, minimum pad ring 10mil, minimum via ring 8mil, stop-mask expansion 0mil, vias tented up to drill 0mil, thermal gap 10mil
Holes 3.2 mm at 3.81,205.74 55.88,205.74

### Footprints (pad centres in the part's own frame; a part is rotated, then mirrored left to right if it is on the bottom)
C063-025X075 = drill 0.813 octagon: 1 -2.54,0; 2 3.81,0
E12-8 = drill 1.016: + -10.16,0 | drill 1.016 octagon: - 10.16,0
EDGE-CON2 = smd 13.106 x 2.032: A1 7.938,4.128; B1 7.938,7.303; C1 7.938,10.477; D1 7.938,13.652; E1 7.938,16.828; F1 7.938,20.003; H1 7.938,23.177; J1 7.938,26.352; K1 7.938,29.527; L1 7.938,32.703; M1 7.938,35.877; N1 7.938,39.053; P1 7.938,42.227; R1 7.938,45.403; S1 7.938,48.578; T1 7.938,51.752; U1 7.938,54.928; V1 7.938,58.102 | smd 13.106 x 2.032 bottom: A2 7.938,4.128; B2 7.938,7.303; C2 7.938,10.477; D2 7.938,13.652; E2 7.938,16.828; F2 7.938,20.003; H2 7.938,23.177; J2 7.938,26.352; K2 7.938,29.527; L2 7.938,32.703; M2 7.938,35.877; N2 7.938,39.053; P2 7.938,42.227; R2 7.938,45.403; S2 7.938,48.578; T2 7.938,51.752; U2 7.938,54.928; V2 7.938,58.102
DIL14 = drill 0.813 long: 1 -7.62,-3.81; 2 -5.08,-3.81; 3 -2.54,-3.81; 4 0,-3.81; 5 2.54,-3.81; 6 5.08,-3.81; 7 7.62,-3.81; 8 7.62,3.81; 9 5.08,3.81; 10 2.54,3.81; 11 0,3.81; 12 -2.54,3.81; 13 -5.08,3.81; 14 -7.62,3.81
DIL16 = drill 0.813 long: 1 -8.89,-3.81; 2 -6.35,-3.81; 3 -3.81,-3.81; 4 -1.27,-3.81; 5 1.27,-3.81; 6 3.81,-3.81; 7 6.35,-3.81; 8 8.89,-3.81; 9 8.89,3.81; 10 6.35,3.81; 11 3.81,3.81; 12 1.27,3.81; 13 -1.27,3.81; 14 -3.81,3.81; 15 -6.35,3.81; 16 -8.89,3.81
TO5 = drill 0.813 octagon: 1 0,-2.54; 2 2.54,0; 3 0,2.54
0207/10 = drill 0.813 octagon: 1 -5.08,0; 2 5.08,0
EDGE-CON8 = smd 2.032 x 13.106: AA1 261.303,7.938; AB1 258.127,7.938; AC1 254.952,7.938; AD1 251.778,7.938; AE1 248.602,7.938; AF1 245.428,7.938; AH1 242.252,7.938; AJ1 239.077,7.938; AK1 235.903,7.938; AL1 232.727,7.938; AM1 229.553,7.938; AN1 226.377,7.938; AP1 223.202,7.938; AR1 220.028,7.938; AS1 216.852,7.938; AT1 213.678,7.938; AU1 210.502,7.938; AV1 207.327,7.938; BA1 191.452,7.938; BB1 188.278,7.938; BC1 185.102,7.938; BD1 181.928,7.938; BE1 178.752,7.938; BF1 175.577,7.938; BH1 172.403,7.938; BJ1 169.227,7.938; BK1 166.053,7.938; BL1 162.877,7.938; BM1 159.702,7.938; BN1 156.528,7.938; BP1 153.352,7.938; BR1 150.178,7.938; BS1 147.002,7.938; BT1 143.827,7.938; BU1 140.653,7.938; BV1 137.477,7.938; CA1 127.953,7.938; CB1 124.778,7.938; CC1 121.603,7.938; CD1 118.427,7.938; CE1 115.252,7.938; CF1 112.078,7.938; CH1 108.903,7.938; CJ1 105.728,7.938; CK1 102.552,7.938; CL1 99.377,7.938; CM1 96.203,7.938; CN1 93.028,7.938; CP1 89.853,7.938; CR1 86.677,7.938; CS1 83.502,7.938; CT1 80.328,7.938; CU1 77.153,7.938; CV1 73.978,7.938; DA1 58.102,7.938; DB1 54.928,7.938; DC1 51.752,7.938; DD1 48.578,7.938; DE1 45.403,7.938; DF1 42.227,7.938; DH1 39.053,7.938; DJ1 35.877,7.938; DK1 32.703,7.938; DL1 29.527,7.938; DM1 26.352,7.938; DN1 23.177,7.938; DP1 20.003,7.938; DR1 16.828,7.938; DS1 13.652,7.938; DT1 10.477,7.938; DU1 7.303,7.938; DV1 4.128,7.938 | smd 2.032 x 13.106 bottom: AA2 261.303,7.938; AB2 258.127,7.938; AC2 254.952,7.938; AD2 251.778,7.938; AE2 248.602,7.938; AF2 245.428,7.938; AH2 242.252,7.938; AJ2 239.077,7.938; AK2 235.903,7.938; AL2 232.727,7.938; AM2 229.553,7.938; AN2 226.377,7.938; AP2 223.202,7.938; AR2 220.028,7.938; AS2 216.852,7.938; AT2 213.678,7.938; AU2 210.502,7.938; AV2 207.327,7.938; BA2 191.452,7.938; BB2 188.278,7.938; BC2 185.102,7.938; BD2 181.928,7.938; BE2 178.752,7.938; BF2 175.577,7.938; BH2 172.403,7.938; BJ2 169.227,7.938; BK2 166.053,7.938; BL2 162.877,7.938; BM2 159.702,7.938; BN2 156.528,7.938; BP2 153.352,7.938; BR2 150.178,7.938; BS2 147.002,7.938; BT2 143.827,7.938; BU2 140.653,7.938; BV2 137.477,7.938; CA2 127.953,7.938; CB2 124.778,7.938; CC2 121.603,7.938; CD2 118.427,7.938; CE2 115.252,7.938; CF2 112.078,7.938; CH2 108.903,7.938; CJ2 105.728,7.938; CK2 102.552,7.938; CL2 99.377,7.938; CM2 96.203,7.938; CN2 93.028,7.938; CP2 89.853,7.938; CR2 86.677,7.938; CS2 83.502,7.938; CT2 80.328,7.938; CU2 77.153,7.938; CV2 73.978,7.938; DA2 58.102,7.938; DB2 54.928,7.938; DC2 51.752,7.938; DD2 48.578,7.938; DE2 45.403,7.938; DF2 42.227,7.938; DH2 39.053,7.938; DJ2 35.877,7.938; DK2 32.703,7.938; DL2 29.527,7.938; DM2 26.352,7.938; DN2 23.177,7.938; DP2 20.003,7.938; DR2 16.828,7.938; DS2 13.652,7.938; DT2 10.477,7.938; DU2 7.303,7.938; DV2 4.128,7.938

### Placement (x,y rotation side)
C1  165.1,111.76 270 top
C2  252.73,59.69 180 top
C3  227.33,96.52 180 top
C4  227.33,128.27 180 top
C6  135.89,147.32 270 top
C7  124.46,60.96 180 top
C8  119.38,114.3 270 top
C9  115.57,146.05 270 top
C10  91.44,142.24 270 top
C11  77.47,124.46 180 top
C12  74.93,160.02 180 top
C13  59.69,25.4 180 top
C14  58.42,125.73 180 top
C15  53.34,161.29 180 top
C16  46.99,191.77 180 top
C17  36.83,54.61 180 top
C18  34.29,128.27 180 top
C19  34.29,165.1 180 top
C20  34.29,191.77 180 top
C21  12.7,25.4 180 top
C22  13.97,55.88 180 top
C23  11.43,96.52 180 top
C24  12.7,130.81 180 top
C25  12.7,163.83 180 top
C26  13.97,191.77 180 top
C27  250.19,20.32 180 top
C29  118.11,31.75 270 top
C30  72.39,111.76 270 top
C31  69.85,73.66 270 top
C32  252.73,88.9 180 top
C33  194.31,35.56 270 top
E  203.2,210.82 270 top
E1  252.73,38.1 270 top
E2  252.73,73.66 270 top
E3  252.73,109.22 270 top
E4  252.73,144.78 270 top
E5  254,180.34 270 top
E6  227.33,38.1 270 top
E7  226.06,73.66 270 top
E8  226.06,109.22 270 top
E9  226.06,144.78 270 top
E10  231.14,176.53 270 top
E11  201.93,39.37 270 top
E12  201.93,76.2 270 top
E13  200.66,111.76 270 top
E14  200.66,144.78 270 top
E15  175.26,38.1 270 top
E16  179.07,73.66 270 top
E17  175.26,109.22 270 top
E18  175.26,144.78 270 top
E19  167.64,180.34 270 top
E20  152.4,38.1 270 top
E21  152.4,73.66 270 top
E22  151.13,109.22 270 top
E23  151.13,144.78 270 top
E24  148.59,181.61 270 top
E25  129.54,38.1 270 top
E26  127,73.66 270 top
E27  128.27,109.22 270 top
E28  127,144.78 270 top
E29  101.6,38.1 270 top
E30  104.14,73.66 270 top
E31  104.14,109.22 270 top
E32  105.41,144.78 270 top
E33  92.71,180.34 270 top
E34  80.01,38.1 270 top
E35  80.01,73.66 270 top
E36  81.28,109.22 270 top
E37  77.47,144.78 270 top
E38  72.39,180.34 270 top
E39  58.42,38.1 270 top
E40  57.15,73.66 270 top
E41  58.42,109.22 270 top
E42  55.88,144.78 270 top
E43  52.07,179.07 270 top
E44  36.83,38.1 270 top
E45  34.29,73.66 270 top
E46  34.29,107.95 270 top
E47  34.29,144.78 270 top
E48  34.29,179.07 270 top
E49  12.7,38.1 270 top
E50  12.7,73.66 270 top
E51  12.7,109.22 270 top
E52  12.7,144.78 270 top
E53  12.7,179.07 270 top
F  133.35,210.82 270 top
H  69.85,210.82 270 top
Q1  215.9,68.58 270 top
R1  93.98,144.78 90 top
R2  205.74,167.64 90 top
R3  119.38,181.61 270 top
R4  111.76,181.61 270 top
R5  114.3,181.61 270 top
R6  116.84,181.61 270 top
R7  60.96,181.61 90 top
R8  21.59,181.61 90 top
R9  109.22,181.61 270 top
R10  236.22,38.1 90 top
R11  45.72,144.78 90 top
R12  186.69,38.1 90 top
R13  22.86,144.78 90 top
R14  238.76,181.61 90 top
R15  24.13,181.61 90 top
R16  115.57,111.76 90 top
R17  210.82,172.72 90 top
R19  241.3,45.72 90 top
R20  218.44,172.72 90 top
R21  203.2,167.64 90 top
R22  213.36,172.72 90 top
R23  200.66,167.64 90 top
R24  215.9,172.72 90 top
R25  234.95,146.05 90 top
R26  191.77,38.1 90 top
R27  241.3,181.61 90 top
R28  182.88,146.05 90 top
R29  68.58,38.1 90 top
R30  166.37,146.05 90 top
R31  101.6,181.61 90 top
R32  182.88,111.76 90 top
R33  22.86,90.17 90 top
R34  43.18,181.61 90 top
R35  170.18,72.39 90 top
R36  184.15,38.1 90 top
R37  189.23,38.1 90 top
R38  212.09,38.1 90 top
U$2  0,0 0 top

### Tracks (layer width: path | path; a pad name or v marks a point on that pad's centre or on a via)
!AC0EQAC1  (1 unrouted)
  Top 0.406: F.F1 153.67,203.2 153.67,196.85 152.72,195.9 144.78,193.36 142.88,192.41 141.92,190.82
!AC2_AC3  (2 unrouted)
!AC2BUS  (8 unrouted)
!AC04-11EQ0  (2 unrouted)
!AC_LOAD  (4 unrouted)
!AD00  (2 unrouted)
!AD01  (1 unrouted)
!AD10  (1 unrouted)
!AD11  (1 unrouted)
!AD_LD_D15  (1 unrouted)
!ADLK  (1 unrouted)
!AL2MQ_ENA  (1 unrouted)
!AND  (2 unrouted)
!ANDE  (1 unrouted)
!BK_DC  (1 unrouted)
!BUS_STROBE  (1 unrouted)
!C0  (2 unrouted)
!C1  (3 unrouted)
!C2  (5 unrouted)
!CARRY_IN  (9 unrouted)
!CARRY_OUT  (4 unrouted)
!CPMA_DIS  (2 unrouted)
!CPMA_LOAD  (4 unrouted)
!D  (1 unrouted)
!DCA  (2 unrouted)
!DCAE  (1 unrouted)
!DSET  (2 unrouted)
!E  (via drill 0.81)  (3 unrouted)
  Top 0.406: v20.95,20.32 10.79,20.32 7.94,23.18 6.67,25.4 v6.67,29.21 5.71,36.83 5.71,73.66 4.76,75.56 4.76,88.9 3.81,91.44 3.81,128.27 3.49,148.27 3.49,148.59 v6.35,156.84
  Bottom 0.406: E49.4 6.67,36.2 v6.67,29.21 | E47.1 26.67,153.99 22.23,157.48 14.61,157.48 v6.35,156.84
!ESET  (1 unrouted)
!ETS2  (3 unrouted)
!ETS3  (4 unrouted)
!F  (3 unrouted)
!FDSET  (1 unrouted)
  Bottom 0.406: E39.12 63.5,40.64 64.77,39.37 64.77,35.56 | 64.77,35.56 E39.10 | R29.1 64.77,35.56
!FE_FD  (3 unrouted)
!FESET  (4 unrouted)
!FSET  (4 unrouted)
!IOT  (2 unrouted)
!IR0  (via drill 0.81)  (1 unrouted)
  Top 0.406: E44.10 43.81,35.56 v43.81,21.59
  Bottom 0.406: U$2.DD2 48.26,10.16 48.26,17.78 45.72,20.32 v43.81,21.59
!IR1  (via drill 0.81)  (1 unrouted)
  Top 0.406: v41.27,21.59 38.73,29.53 38.73,41.59 E44.13
  Bottom 0.406: U$2.DE2 45.72,8.89 45.72,15.24 v41.27,21.59
!IR2  (via drill 0.81)  (2 unrouted)
  Bottom 0.406: U$2.DH2 39.37,8.89 39.37,16.51 v33.02,22.86
!ISZ  (2 unrouted)
!JMP  (3 unrouted)
!JMS  (3 unrouted)
!KEYCONTROL  (via drill 0.81)  (3 unrouted)
  Bottom 0.406: U$2.DU2 7.62,8.89 7.62,15.24 15.24,21.59 21.59,26.35 24.77,26.35 v26.04,24.77
!LA_ENABLE  (1 unrouted)
!LEFT  (6 unrouted)
  Top 0.406: F.D1 147.32,200.66 147,196.53 144.78,195.58 141.92,193.99 140.02,191.45
!LINK  (2 unrouted)
!LINK_DATA  (1 unrouted)
!LINK_LOAD  (2 unrouted)
!MAC  (1 unrouted)
!MALC  (1 unrouted)
!MB_LOAD  (1 unrouted)
!MD00  (1 unrouted)
!MD01  (1 unrouted)
!MD02  (1 unrouted)
!MD03  (1 unrouted)
!MD04  (2 unrouted)
!MD05  (2 unrouted)
!MD06  (1 unrouted)
!MD07  (2 unrouted)
!MD08  (2 unrouted)
!MD09  (1 unrouted)
!MD10  (1 unrouted)
!MD11  (2 unrouted)
  Top 0.406: U$2.DP1 20.32,8.89
!MQ00  (1 unrouted)
!MQ00-03EQ0  (1 unrouted)
!MQ2BUS  (4 unrouted)
!MQ04-11EQ0  (1 unrouted)
!MQ10  (1 unrouted)
  Top 0.406: F.A1 137.16,201.93 137.16,193.04
!MQ11  (1 unrouted)
  Top 0.406: F.B1 140.97,201.93 140.97,196.85 139.06,194.63 138.11,192.72
!MQ_DATA  (1 unrouted)
!MQ_LOAD  (3 unrouted)
!MS_DIS  (8 unrouted)
!MS_IR_DIS  (1 unrouted)
!OP1  (4 unrouted)
!OPR  (2 unrouted)
!OPR_IOT  (3 unrouted)
!OPRF  (1 unrouted)
!OVERFLOW  (1 unrouted)
!PAUSE  (3 unrouted)
!PC_LOAD  (5 unrouted)
!RIGHT  (6 unrouted)
  Top 0.406: F.C1 143.51,201.93 143.51,196.22 140.97,194.63 139.06,192.09
!ROM  (1 unrouted)
!SHL_ENA  (1 unrouted)
!SKIP  (1 unrouted)
!TAD  (2 unrouted)
!TADE  (2 unrouted)
!TS1  (1 unrouted)
!TS2  (2 unrouted)
!TS3  (2 unrouted)
!TS4  (1 unrouted)
!TWICE  (4 unrouted)
+3B  (2 unrouted)
+3V  (8 unrouted)
  Bottom 0.813: E50.4 E50.10 20.32,69.85 24.13,69.85 E45.4
+3VA  (3 unrouted)
-15V  (1 unrouted)
AC00  (4 unrouted)
AC01  (3 unrouted)
AC02  (1 unrouted)
AC03  (1 unrouted)
ACEQ0  (2 unrouted)
ANDETS3  (2 unrouted)
BD  (3 unrouted)
BE  (3 unrouted)
BF  (8 unrouted)
BF_KC  (3 unrouted)
BKC  (1 unrouted)
BMD05  (2 unrouted)
BMD06  (2 unrouted)
BMD07  (3 unrouted)
BMD08  (1 unrouted)
BMD09  (1 unrouted)
BMD10  (1 unrouted)
BMD11  (2 unrouted)
BMS_DIS  (2 unrouted)
BTP2  (4 unrouted)
BTP3  (6 unrouted)
BTS1  (4 unrouted)
BTS2  (4 unrouted)
BTS3  (8 unrouted)
BTS4  (4 unrouted)
BUS_STROBE  (2 unrouted)
CPMA_LOAD  (1 unrouted)
  Bottom 0.406: E50.3 E50.11 25.4,73.66 E45.3
D!JMP  (1 unrouted)
DATA_F  (4 unrouted)
DATA_T  (8 unrouted)
DCAETS2  (3 unrouted)
EN0  (6 unrouted)
EN1  (7 unrouted)
EN2  (3 unrouted)
ESET  (2 unrouted)
FE_FD  (1 unrouted)
FSET  (1 unrouted)
GND  (via drill 0.81)  (96 unrouted)
  Top 0.813: E24.7 E24.8 | U$2.DC1 52.07,8.89 52.07,17.78 C13.2 56.52,29.21 57.78,30.48 | U$2.DN1 22.86,8.89 22.86,15.24 27.62,17.78 33.02,20 34.92,21.27 35.88,22.86 v35.88,24.13 | v38.42,23.18 v35.88,24.13 | v35.88,24.13 35.88,30.48 E44.7 | 57.78,30.48 57.78,50.16 55.88,56.52 55.88,66.04 E40.7 | E39.7 57.78,30.48
  Bottom 0.813: U$2.DC1 52.07,8.89 52.07,22.86 | 52.07,22.86 73.66,22.86 | 52.07,22.86 51.12,23.18 v38.42,23.18
IND1  (2 unrouted)
IND2  (2 unrouted)
INITIALIZE  (2 unrouted)
INTINPROG  (2 unrouted)
ISZETS2  (1 unrouted)
ISZETS3  (1 unrouted)
JMP  (3 unrouted)
  Bottom 0.406: E12.3 200.03,80.33 200.03,84.14 198.75,85.09 196.22,85.09
JMSE  (2 unrouted)
JMSETS2  (2 unrouted)
JMSETS3  (2 unrouted)
LINK  (3 unrouted)
MD_DIS  (3 unrouted)
MQEQ0  (1 unrouted)
N$1  (1 unrouted)
N$2  (2 unrouted)
N$3  (4 unrouted)
N$4  (1 unrouted)
N$5  (1 unrouted)
N$6  (2 unrouted)
N$7  (1 unrouted)
N$8  (1 unrouted)
N$9  (4 unrouted)
N$10  (2 unrouted)
N$11  (1 unrouted)
N$12  (1 unrouted)
N$13  (2 unrouted)
N$14  (1 unrouted)
N$15  (3 unrouted)
N$16  (2 unrouted)
  Top 0.813: E24.3 E24.4 | E24.13 E24.12
  Bottom 0.813: E24.4 E24.13
N$17  (2 unrouted)
N$18  (1 unrouted)
N$19  (1 unrouted)
N$20  (1 unrouted)
N$21  (1 unrouted)
N$22  (1 unrouted)
N$23  (1 unrouted)
N$24  (1 unrouted)
N$25  (1 unrouted)
N$26  (2 unrouted)
N$27  (via drill 0.81)
  Top 0.406: v154.94,189.23 157.16,191.77 157.16,194.63 155.89,195.58 154.62,195.58 144.78,192.09 143.51,191.45 142.88,190.18
N$28  (1 unrouted)
N$29  (1 unrouted)
N$30  (5 unrouted)
N$31  (1 unrouted)
N$32  (1 unrouted)
N$33  (1 unrouted)
N$34  (4 unrouted)
N$35  (4 unrouted)
N$36  (1 unrouted)
N$37  (5 unrouted)
N$38  (1 unrouted)
N$39  (1 unrouted)
N$40  (1 unrouted)
N$41  (1 unrouted)
N$42  (1 unrouted)
N$43  (1 unrouted)
N$44  (2 unrouted)
N$45  (1 unrouted)
N$46  (3 unrouted)
N$47  (1 unrouted)
N$48  (3 unrouted)
N$49  (1 unrouted)
N$50  (via drill 0.81)
  Bottom 0.406: v186.69,119.38 185.42,120.65 176.53,121.92 170.5,123.19 166.37,123.19 161.61,120.97 159.7,120.97 156.21,122.56 144.46,122.87
N$51  (1 unrouted)
N$52  (1 unrouted)
N$53  (1 unrouted)
N$54  (1 unrouted)
N$55  (1 unrouted)
N$56  (1 unrouted)
N$57  (1 unrouted)
N$58  (1 unrouted)
N$59  (3 unrouted)
N$60  (1 unrouted)
N$61  (1 unrouted)
N$62  (1 unrouted)
N$63  (2 unrouted)
N$64  (1 unrouted)
N$65  (3 unrouted)
N$66  (1 unrouted)
  Bottom 0.406: E35.11 88.9,78.74 92.71,81.28 99.69,84.77 102.87,84.77 105.73,83.19 109.86,83.19 118.11,81.28 E26.1
N$67  (1 unrouted)
N$69  (1 unrouted)
N$70  (1 unrouted)
N$71  (1 unrouted)
N$72  (1 unrouted)
N$73  (via drill 0.81)
  Top 0.406: E49.5 7.62,36.83 7.62,58.42 v8.89,60.96
  Bottom 0.406: v8.89,60.96 17.78,60.96 20.32,62.23 25.4,67.31 E45.5
N$74  (1 unrouted)
N$75  (1 unrouted)
N$76  (2 unrouted)
N$77  (1 unrouted)
N$78  (1 unrouted)
N$79  (1 unrouted)
N$80  (1 unrouted)
N$81  (1 unrouted)
N$85  (1 unrouted)
OP1TS3  (5 unrouted)
OP2TS3  (1 unrouted)
OPE  (3 unrouted)
  Top 0.406: F.E1 149.86,200.66 149.54,196.22 144.78,194.63 142.56,193.36 140.97,191.13
OPETS3  (2 unrouted)
OPR_IOT  (2 unrouted)
OPRF  (4 unrouted)
OV  (2 unrouted)
PAGEZ  (1 unrouted)
PULSE_LA  (1 unrouted)
PWR_OK  (1 unrouted)
RUN  (1 unrouted)
SKIP1  (2 unrouted)
TADETS3  (3 unrouted)
TP1  (2 unrouted)
TP2  (1 unrouted)
TP3  (1 unrouted)
TP4  (2 unrouted)
TP4!MALC  (2 unrouted)
TS4FSET!MS_DIS  (2 unrouted)
VCC  (via drill 0.81)  (119 unrouted)
  Top 0.813: E24.16 152.4,192.72 v155.26,194.31
  Bottom 0.813: E39.14 66.36,44.77 R29.2

### Text on the board
Top: FLIP CHIP | SIDE 1
Bottom: MAJOR REGISTER CONTROL | SIDE 2 | M8310F
Document: Two VCC airwires are expected.